# EAGLE design icyradio-upconverter (EAGLE 9.5.2)
CREVISION: 1; DESIGNER: Joao Silva

## Sheet 1 of 5: MCU
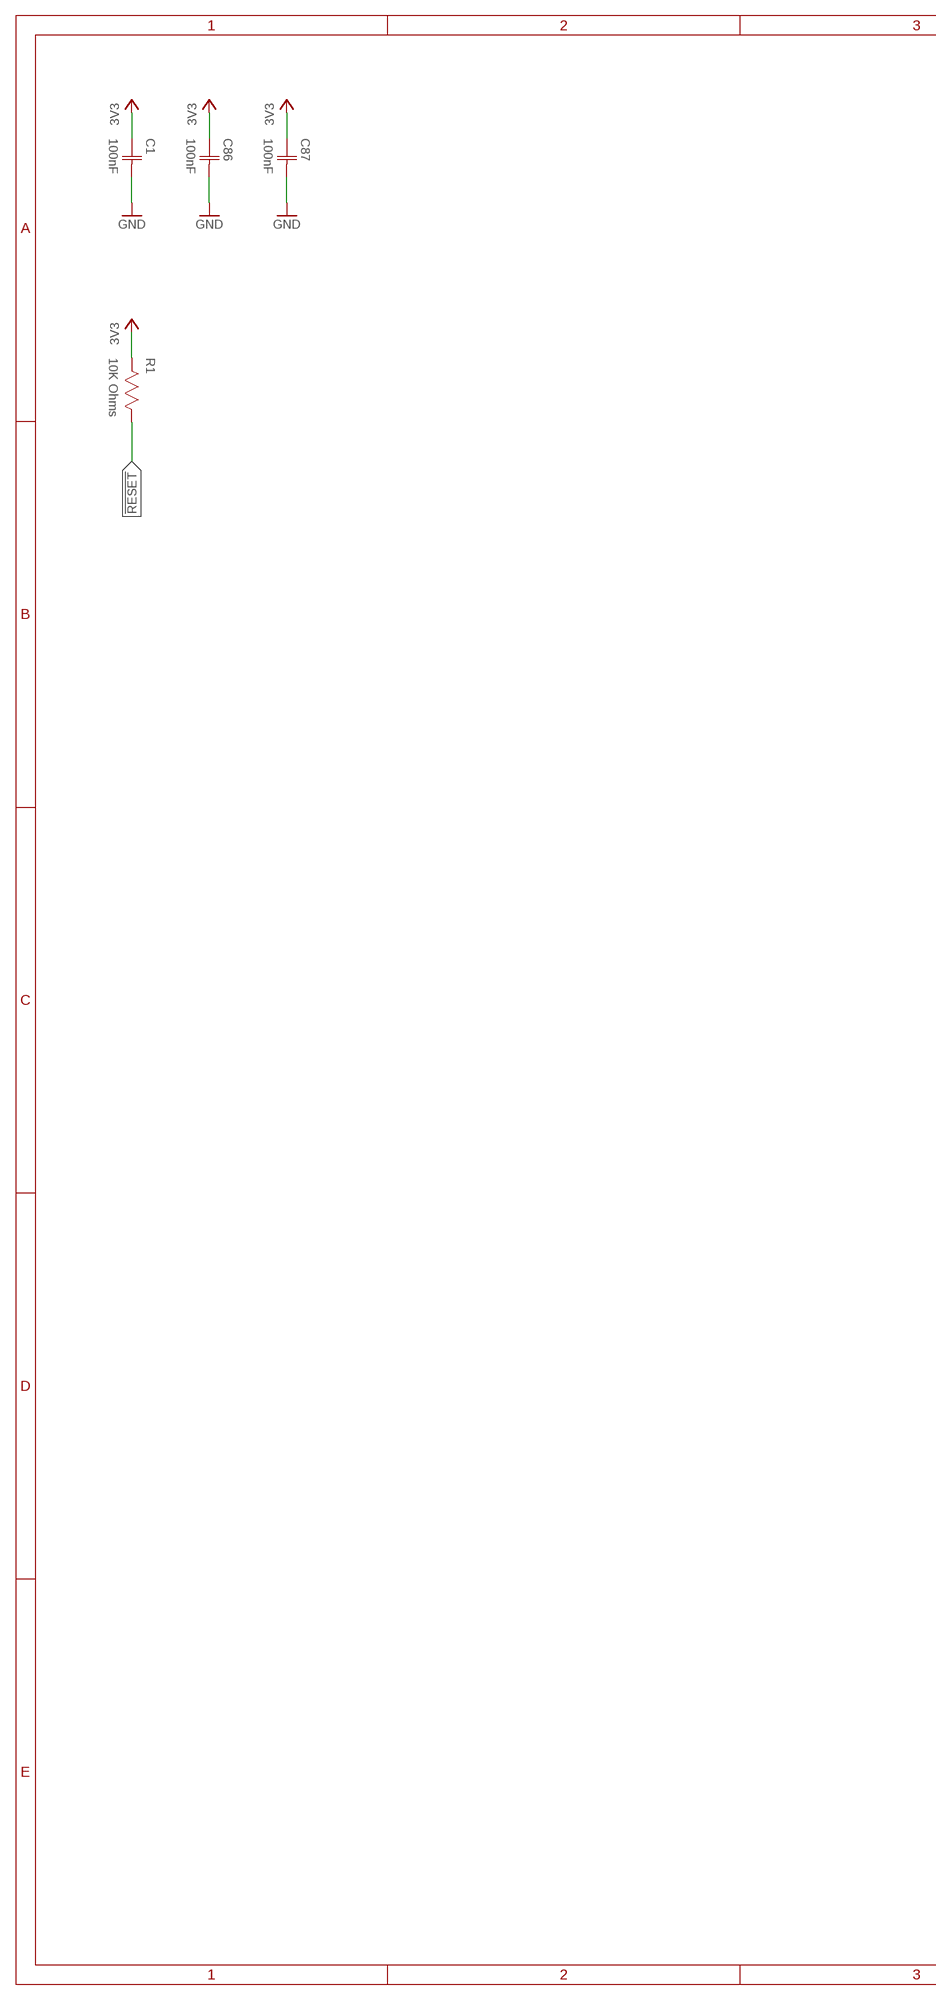
[diagram p0: schematic, sheet 1, part 1 of 2]
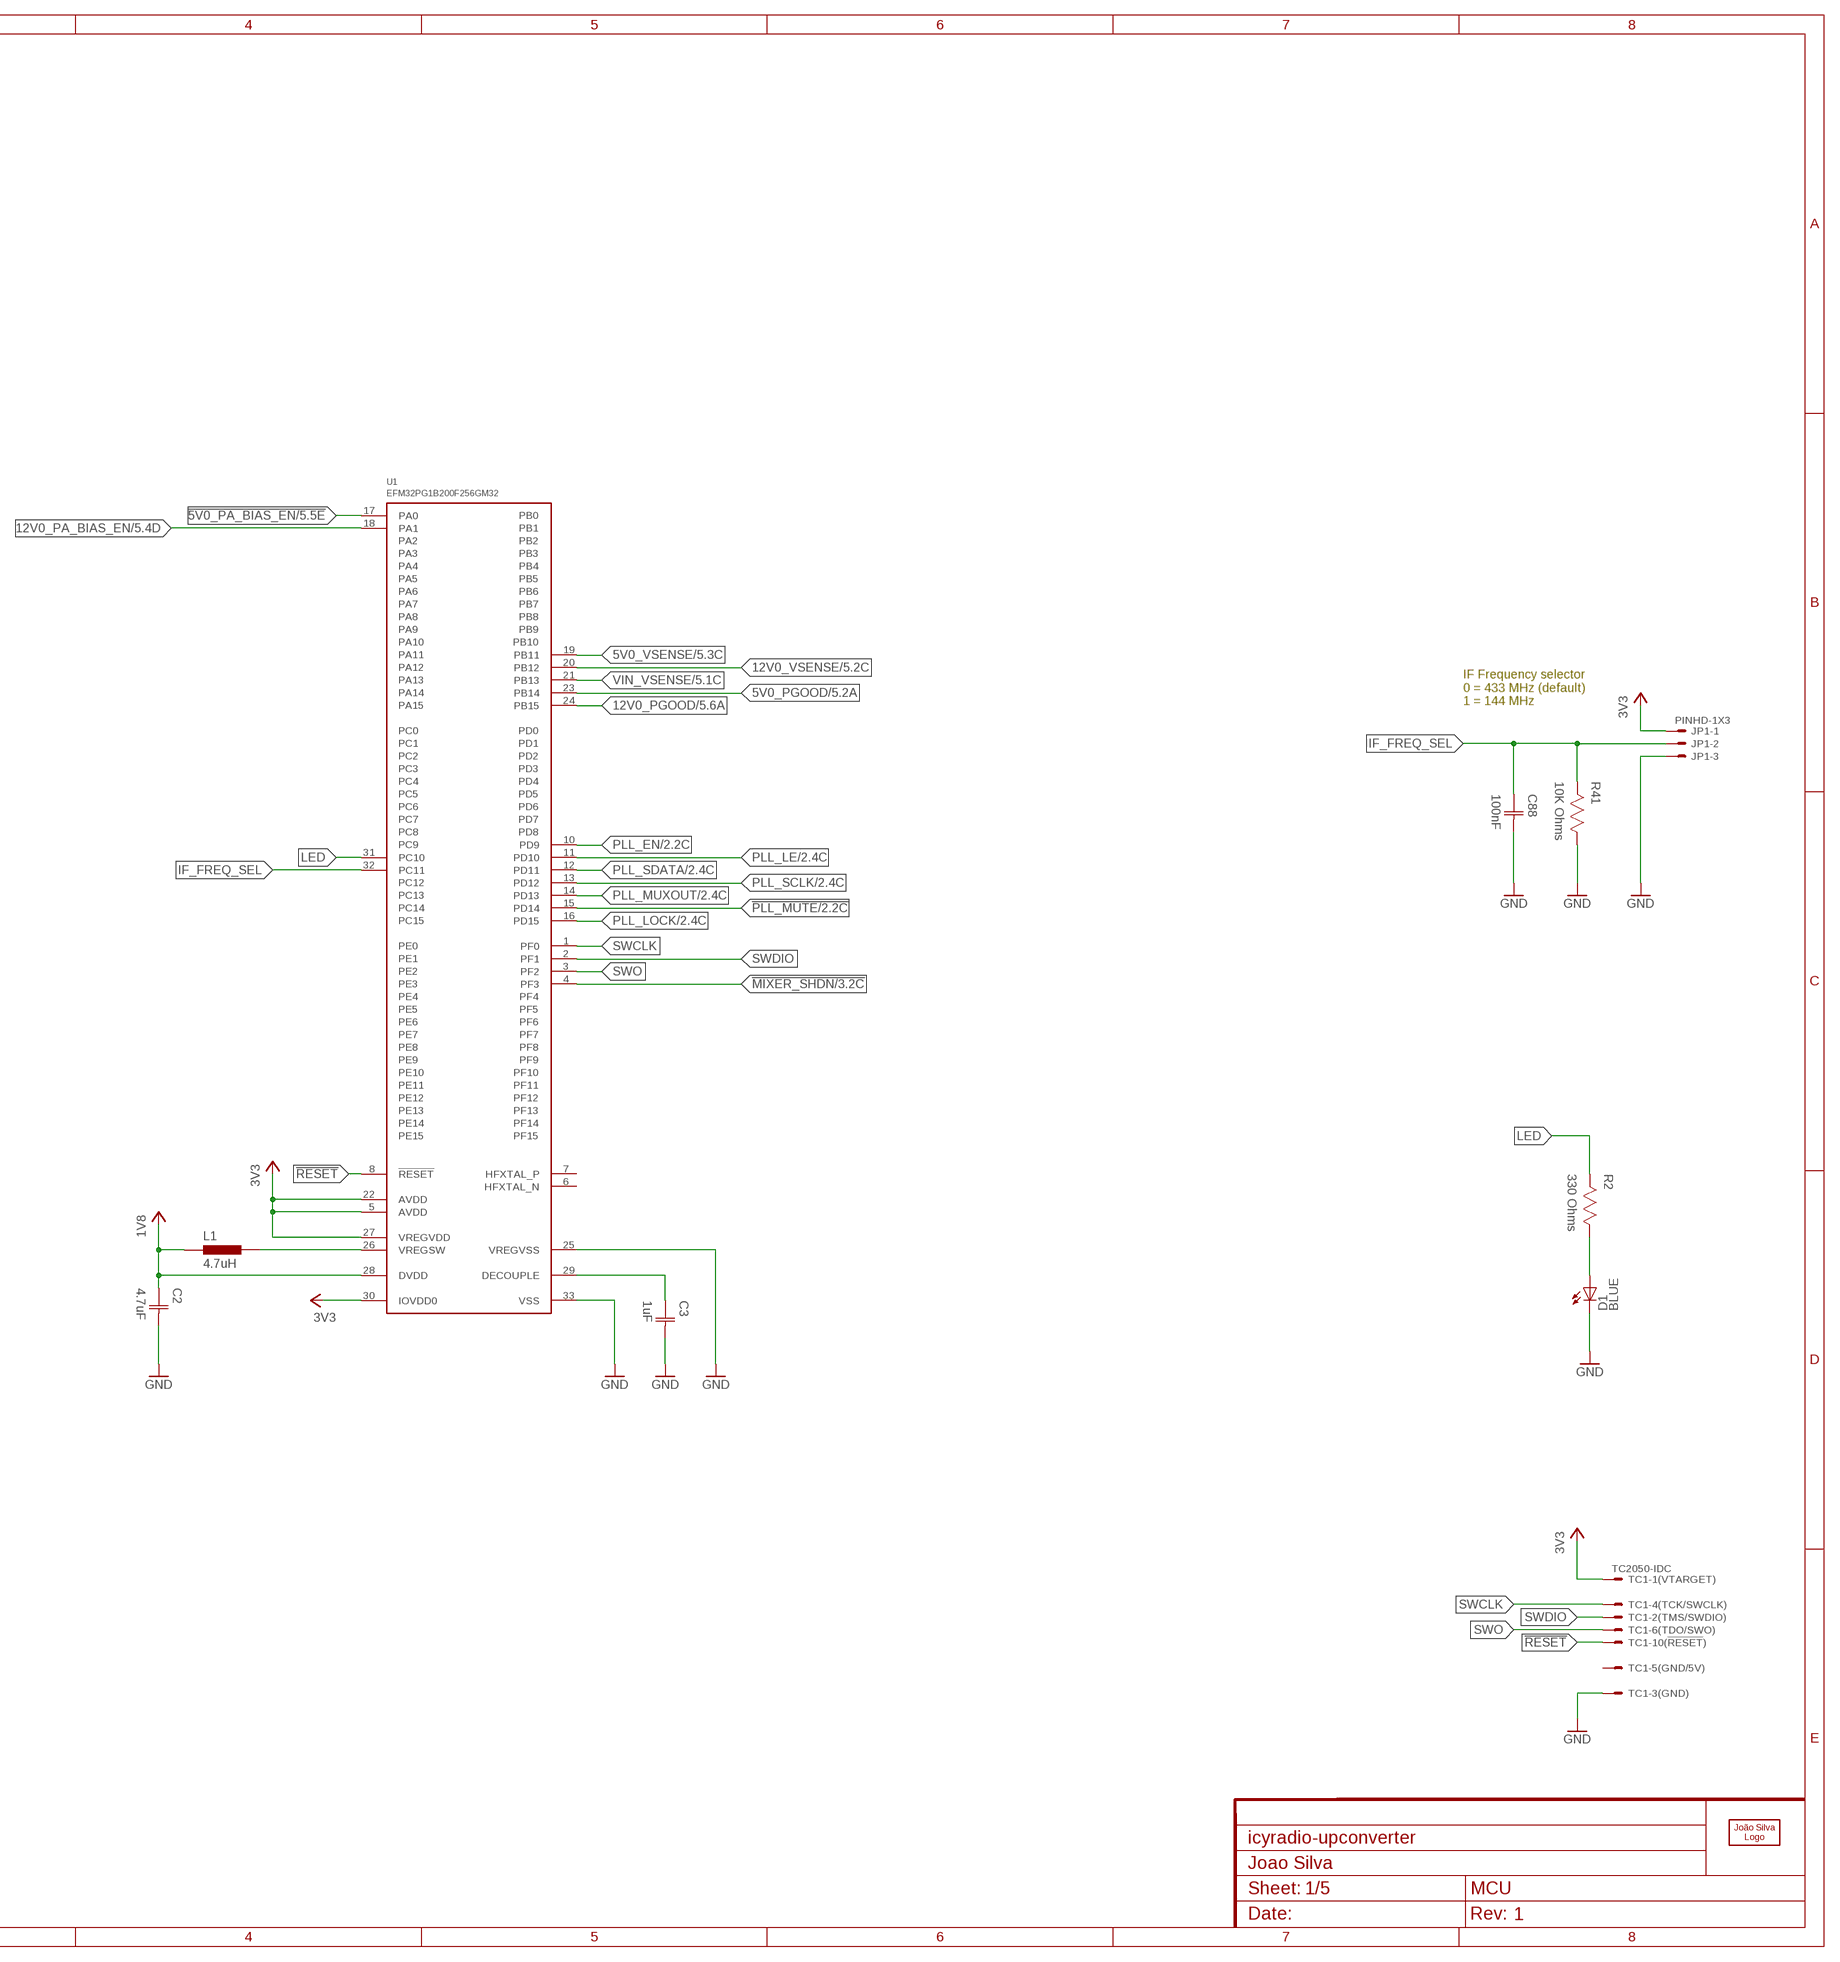
[diagram p1: schematic, sheet 1, part 2 of 2]

### Parts
C1  100nF  CAPACITOR-0603  [CAP0603]
C2  4.7uF  CAPACITOR-0603  [CAP0603]
C3  1uF  CAPACITOR-0603  [CAP0603]
C86  100nF  CAPACITOR-0603  [CAP0603]
C87  100nF  CAPACITOR-0603  [CAP0603]
C88  100nF  CAPACITOR-0603  [CAP0603]
D1  LED0603  [0603]
JP1  PINHD-1X3  [1X03]
L1  4.7uH  INDUCTOR-0603  [IND0603]
LOGO1  JS-5MM  [JS_5MM]
R1  10K Ohms  RESISTOR-0603  [RES0603]
R2  330 Ohms  RESISTOR-0603  [RES0603]
R41  10K Ohms  RESISTOR-0603  [RES0603]
TC1  TC2050-IDC  [TC2050-IDC]
U1  EFM32PG1B200F256GM32  [QFN32_0.5P_JPG]

### Nets
1V8: C2.1(C1) L1.1 U1.28(DVDD)
3V3: C1.1(C1) C86.1(C1) C87.1(C1) JP1.1 R1.2 TC1.1 U1.5(AVDD) U1.22(AVDD) U1.27(VREGVDD) U1.30(IOVDD0) ; also sheet 2,5
5V0_PGOOD: U1.23(PB14) ; also sheet 5
5V0_VSENSE: U1.19(PB11) ; also sheet 5
12V0_PA_BIAS_EN: U1.18(PA1) ; also sheet 5
12V0_PGOOD: U1.24(PB15) ; also sheet 5
12V0_VSENSE: U1.20(PB12) ; also sheet 5
!5V0_PA_BIAS_EN: U1.17(PA0) ; also sheet 5
!MIXER_SHDN: U1.4(PF3) ; also sheet 3
!PLL_MUTE: U1.15(PD14) ; also sheet 2
!RESET: R1.1 TC1.10 U1.8(!RESET)
GND: C1.2(C2) C2.2(C2) C3.2(C2) C86.2(C2) C87.2(C2) C88.2(C2) D1.C JP1.3 R41.1 TC1.3 U1.25(VREGVSS) U1.33(VSS) ; also sheet 2,3,4,5
IF_FREQ_SEL: C88.1(C1) JP1.2 R41.2 U1.32(PC11)
LED: R2.2 U1.31(PC10)
N$21: L1.2 U1.26(VREGSW)
N$22: C3.1(C1) U1.29(DECOUPLE)
N$25: D1.A R2.1
PLL_EN: U1.10(PD9) ; also sheet 2
PLL_LE: U1.11(PD10) ; also sheet 2
PLL_LOCK: U1.16(PD15) ; also sheet 2
PLL_MUXOUT: U1.14(PD13) ; also sheet 2
PLL_SCLK: U1.13(PD12) ; also sheet 2
PLL_SDATA: U1.12(PD11) ; also sheet 2
SWCLK: TC1.4 U1.1(PF0)
SWDIO: TC1.2 U1.2(PF1)
SWO: TC1.6 U1.3(PF2)
VIN_VSENSE: U1.21(PB13) ; also sheet 5
Unconnected: TC1.5 TC1.7 TC1.8 TC1.9 U1.6(HFXTAL_N) U1.7(HFXTAL_P)

### Notes on the sheet
- IF Frequency selector
  0 = 433 MHz (default)
  1 = 144 MHz

## Sheet 2 of 5: LO Synthesizer
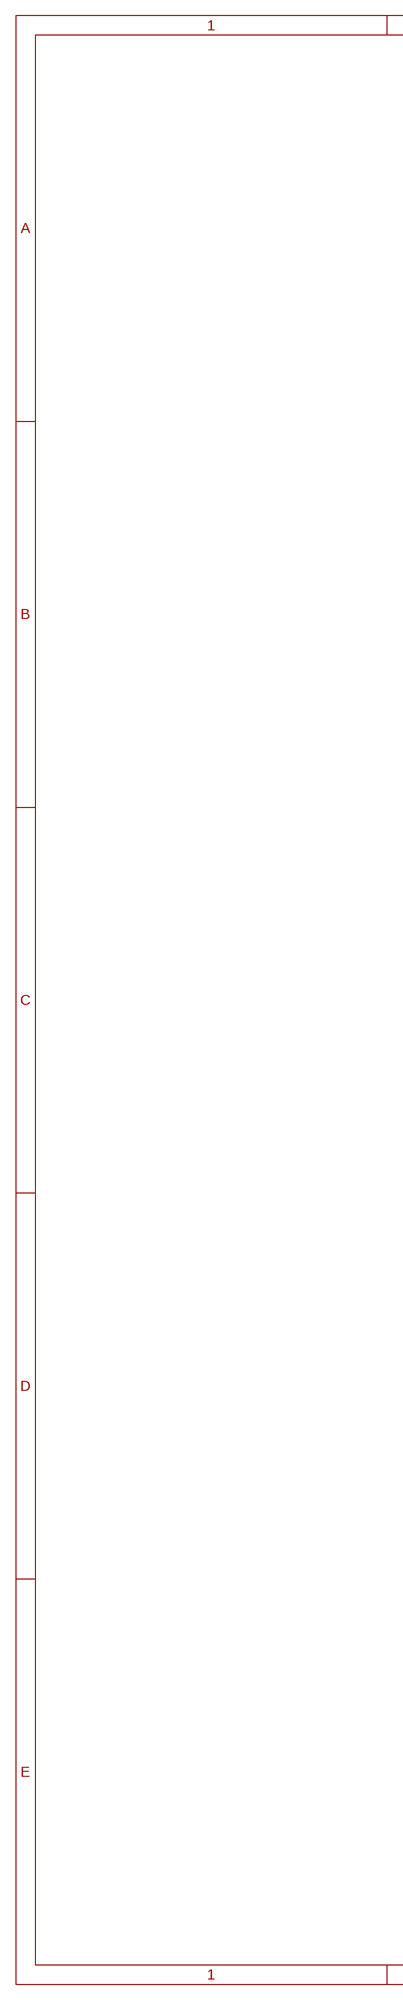
[diagram p2: schematic, sheet 2, part 1 of 2]
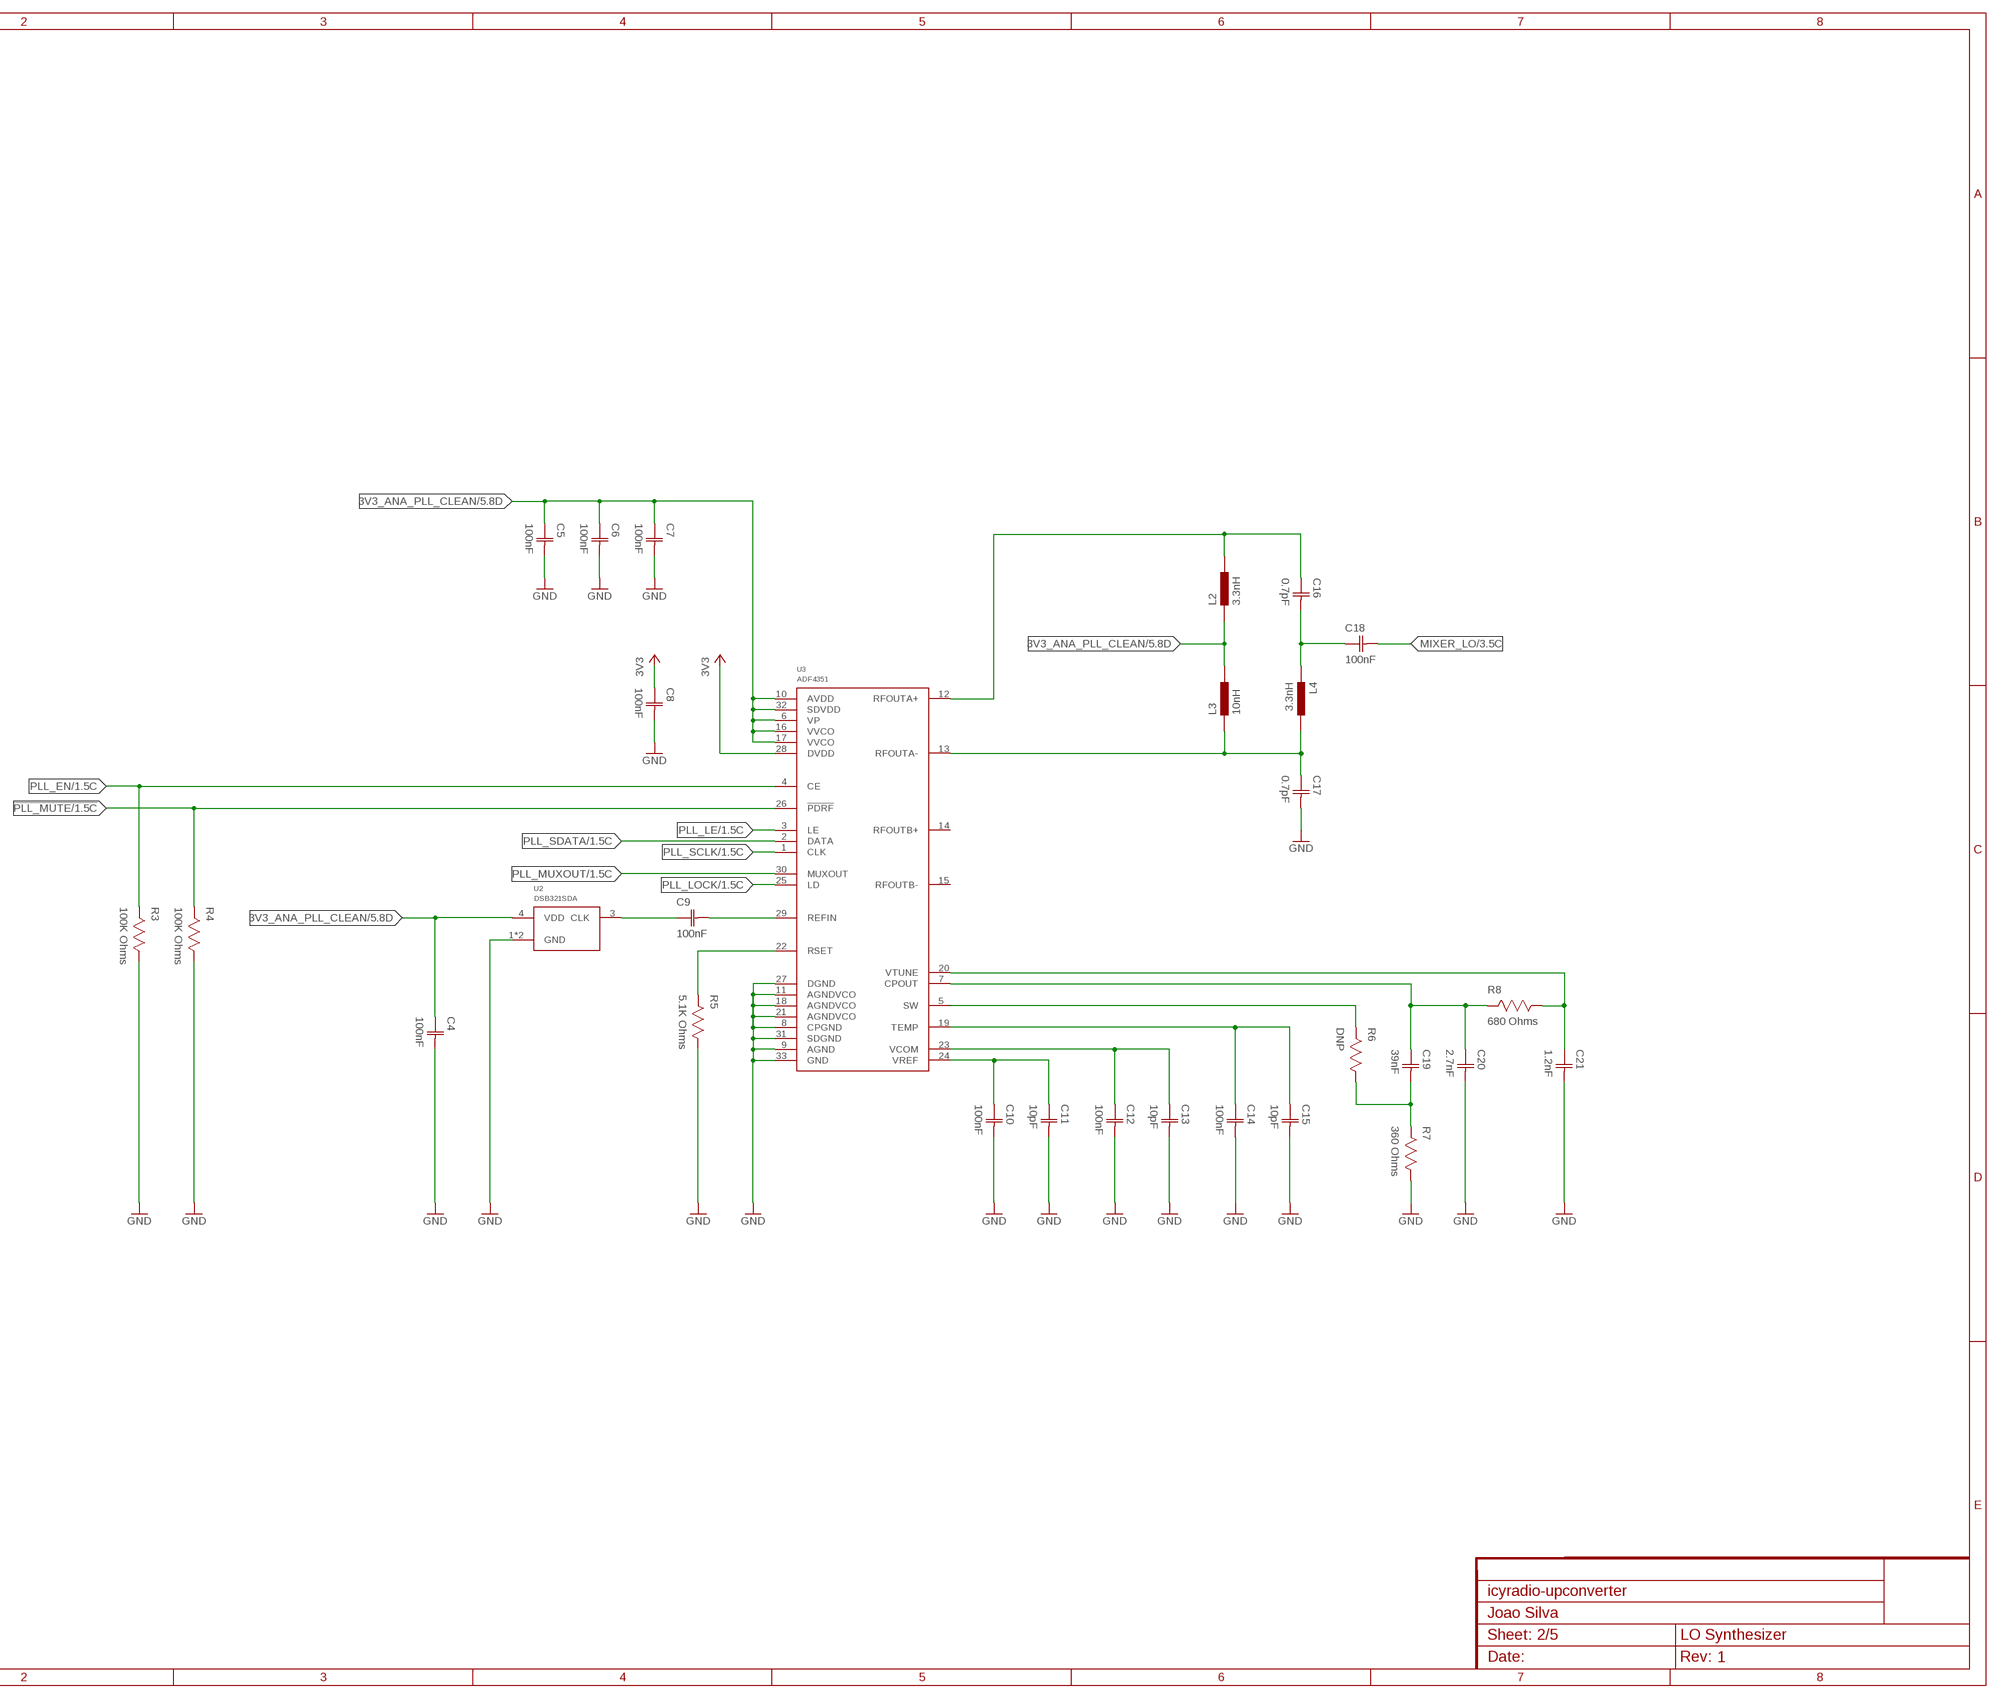
[diagram p3: schematic, sheet 2, part 2 of 2]

### Parts
C4  100nF  CAPACITOR-0603  [CAP0603]
C5  100nF  CAPACITOR-0603  [CAP0603]
C6  100nF  CAPACITOR-0603  [CAP0603]
C7  100nF  CAPACITOR-0603  [CAP0603]
C8  100nF  CAPACITOR-0603  [CAP0603]
C9  100nF  CAPACITOR-0603  [CAP0603]
C10  100nF  CAPACITOR-0603  [CAP0603]
C11  10pF  CAPACITOR-0603  [CAP0603]
C12  100nF  CAPACITOR-0603  [CAP0603]
C13  10pF  CAPACITOR-0603  [CAP0603]
C14  100nF  CAPACITOR-0603  [CAP0603]
C15  10pF  CAPACITOR-0603  [CAP0603]
C16  0.7pF  CAPACITOR-0603  [CAP0603]
C17  0.7pF  CAPACITOR-0603  [CAP0603]
C18  100nF  CAPACITOR-0603  [CAP0603]
C19  39nF  CAPACITOR-0603  [CAP0603]
C20  2.7nF  CAPACITOR-0603  [CAP0603]
C21  1.2nF  CAPACITOR-0603  [CAP0603]
L2  3.3nH  INDUCTOR-0603  [IND0603]
L3  10nH  INDUCTOR-0603  [IND0603]
L4  3.3nH  INDUCTOR-0603  [IND0603]
R3  100K Ohms  RESISTOR-0603  [RES0603]
R4  100K Ohms  RESISTOR-0603  [RES0603]
R5  5.1K Ohms  RESISTOR-0603  [RES0603]
R6  DNP  RESISTOR-0603  [RES0603]
R7  360 Ohms  RESISTOR-0603  [RES0603]
R8  680 Ohms  RESISTOR-0603  [RES0603]
U2  DSB321SDA  [TCXO-3225]
U3  ADF4351  [QFN32]

### Nets
3V3: C8.1(C1) U3.28(DVDD) ; also sheet 1,5
3V3_ANA_PLL_CLEAN: C4.1(C1) C5.1(C1) C6.1(C1) C7.1(C1) L2.1 L3.2 U2.4(VDD) U3.6(VP) U3.10(AVDD) U3.16(VVCO) U3.17(VVCO) U3.32(SDVDD) ; also sheet 5
!PLL_MUTE: R4.2 U3.26(!PDRF) ; also sheet 1
GND: C4.2(C2) C5.2(C2) C6.2(C2) C7.2(C2) C8.2(C2) C10.2(C2) C11.2(C2) C12.2(C2) C13.2(C2) C14.2(C2) C15.2(C2) C17.2(C2) C20.2(C2) C21.2(C2) R3.1 R4.1 R5.1 R7.1 U2.1(GND) U2.2(GND) U3.8(CPGND) U3.9(AGND) U3.11(AGNDVCO) U3.18(AGNDVCO) U3.21(AGNDVCO) U3.27(DGND) U3.31(SDGND) U3.33(GND) ; also sheet 1,3,4,5
MIXER_LO: C18.2(C2) ; also sheet 3
N$1: C16.2(C2) C18.1(C1) L4.1
N$67: C17.1(C1) L3.1 L4.2 U3.13(RFOUTA-)
N$69: C16.1(C1) L2.2 U3.12(RFOUTA+)
N$84: C19.2(C2) R6.1 R7.2
N$88: R5.2 U3.22(RSET)
PLL_CP_VOUT: C19.1(C1) C20.1(C1) R8.2 U3.7(CPOUT)
PLL_EN: R3.2 U3.4(CE) ; also sheet 1
PLL_FASTLOCK_SW: R6.2 U3.5(SW)
PLL_LE: U3.3(LE) ; also sheet 1
PLL_LOCK: U3.25(LD) ; also sheet 1
PLL_MUXOUT: U3.30(MUXOUT) ; also sheet 1
PLL_REF_ACC: C9.2(C2) U3.29(REFIN)
PLL_REF_DCC: C9.1(C1) U2.3(CLK)
PLL_SCLK: U3.1(CLK) ; also sheet 1
PLL_SDATA: U3.2(DATA) ; also sheet 1
PLL_TEMP: C14.1(C1) C15.1(C1) U3.19(TEMP)
PLL_VCOM: C12.1(C1) C13.1(C1) U3.23(VCOM)
PLL_VREF: C10.1(C1) C11.1(C1) U3.24(VREF)
PLL_VTUNE: C21.1(C1) R8.1 U3.20(VTUNE)
Unconnected: U3.14(RFOUTB+) U3.15(RFOUTB-)

## Sheet 3 of 5: Mixer + Filter
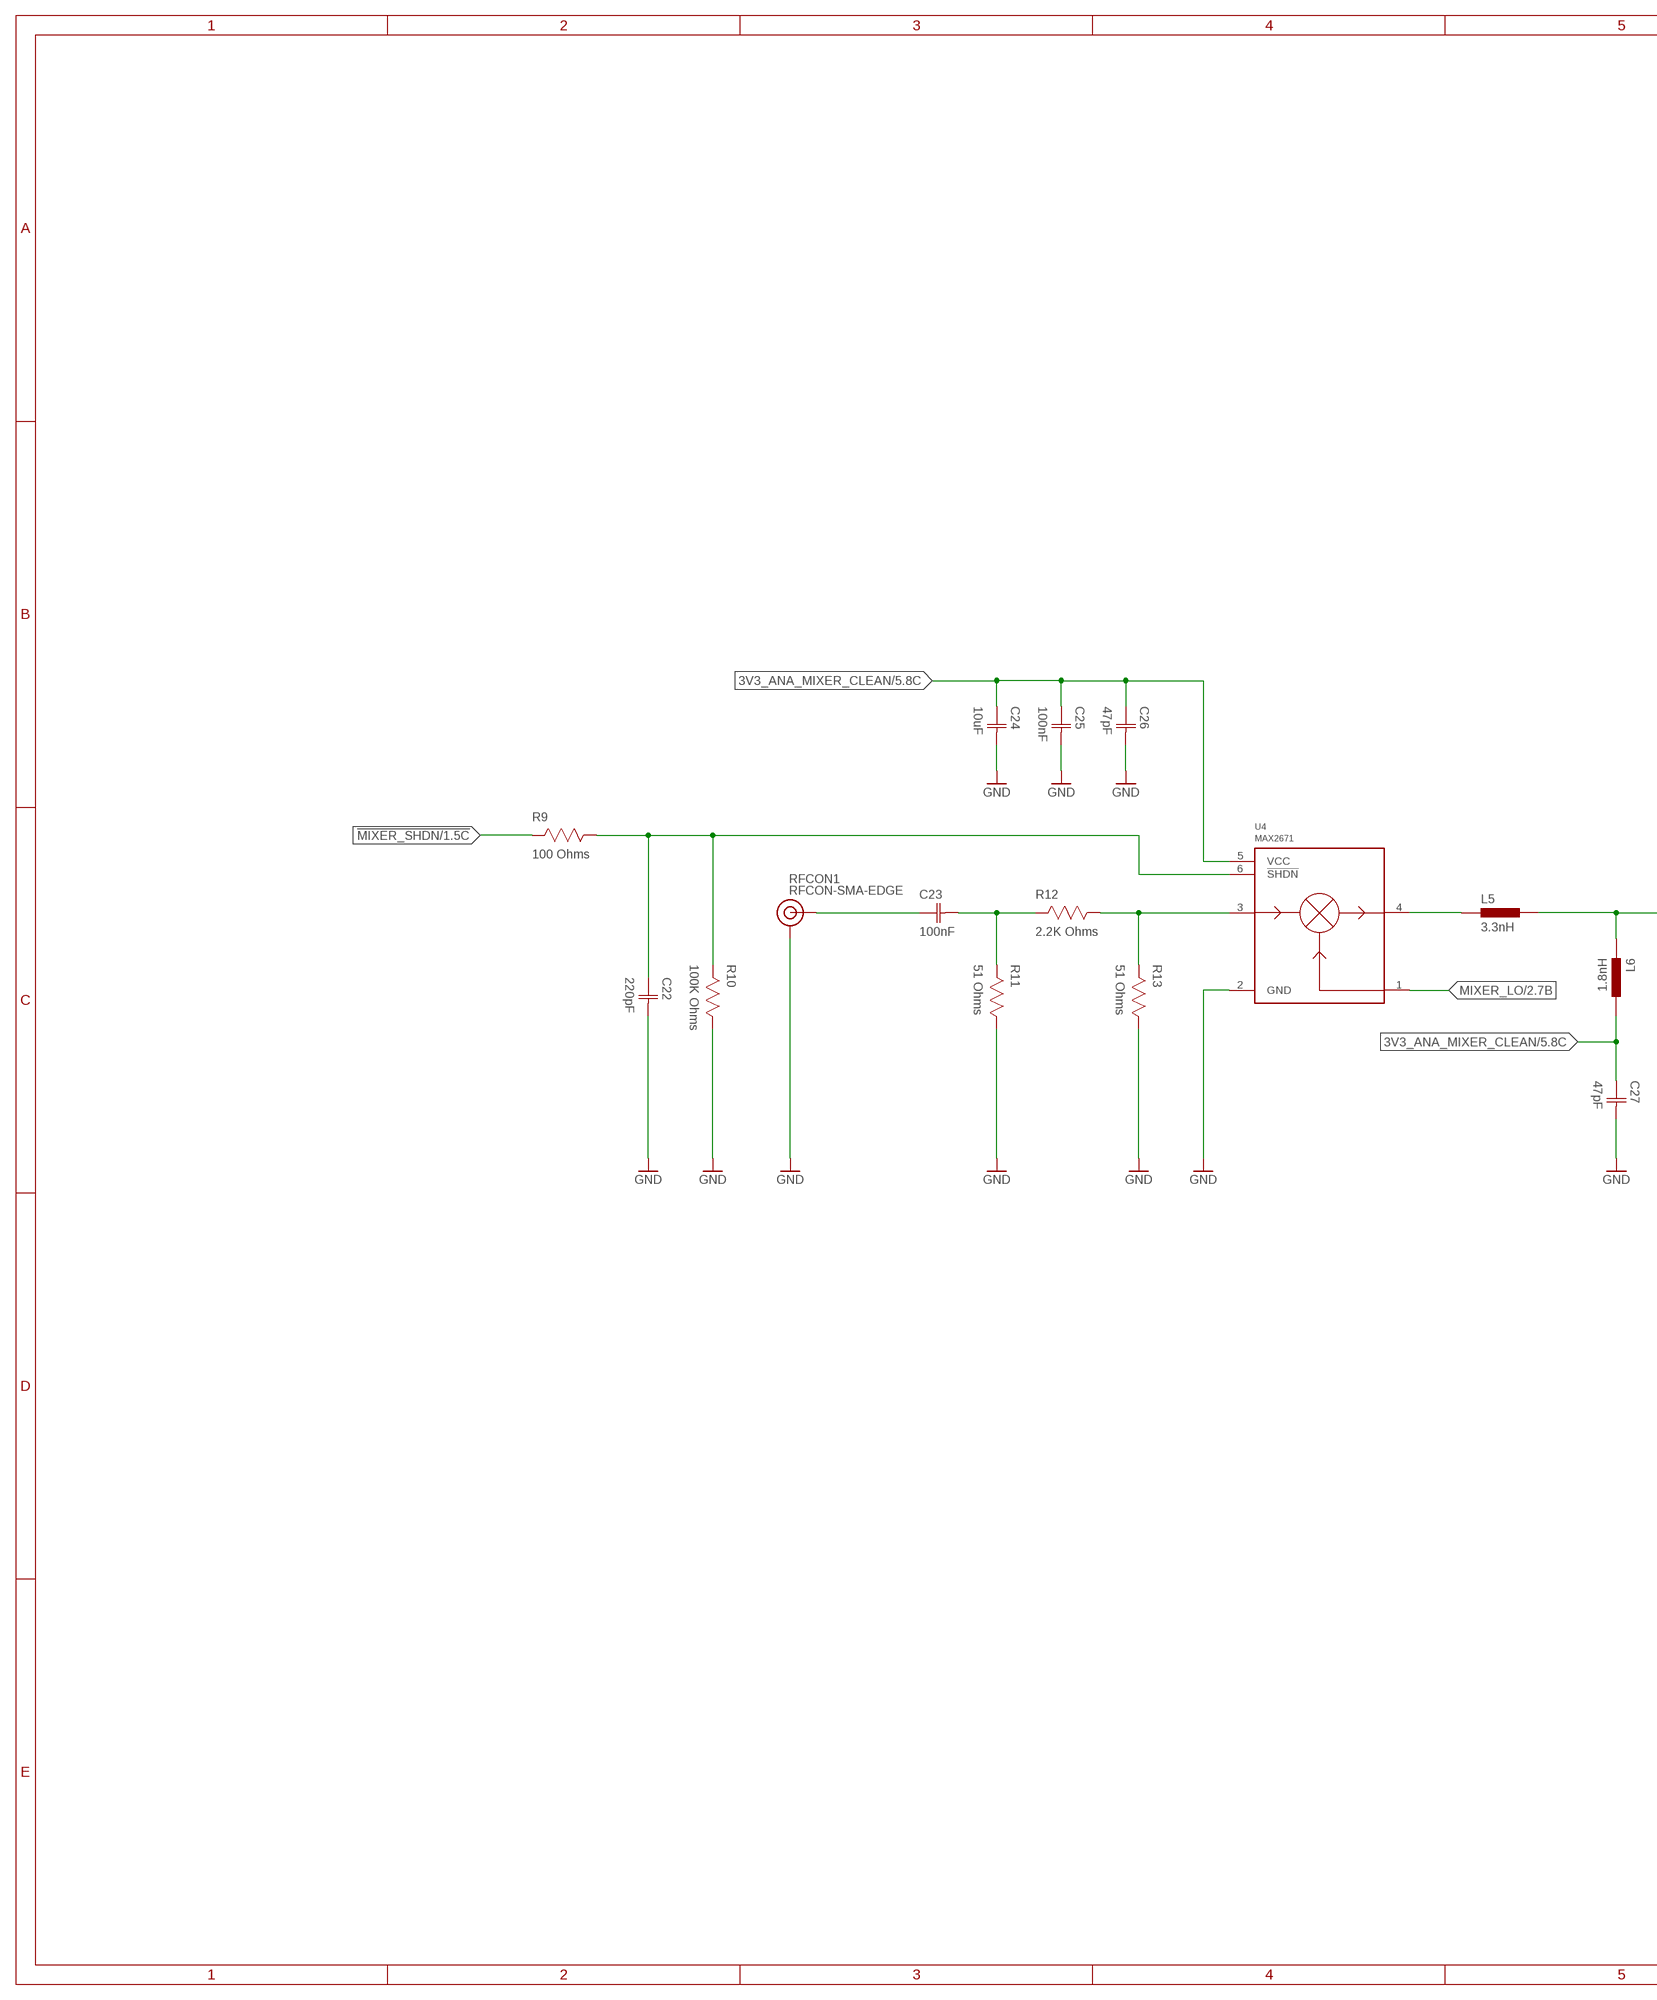
[diagram p4: schematic, sheet 3, part 1 of 2]
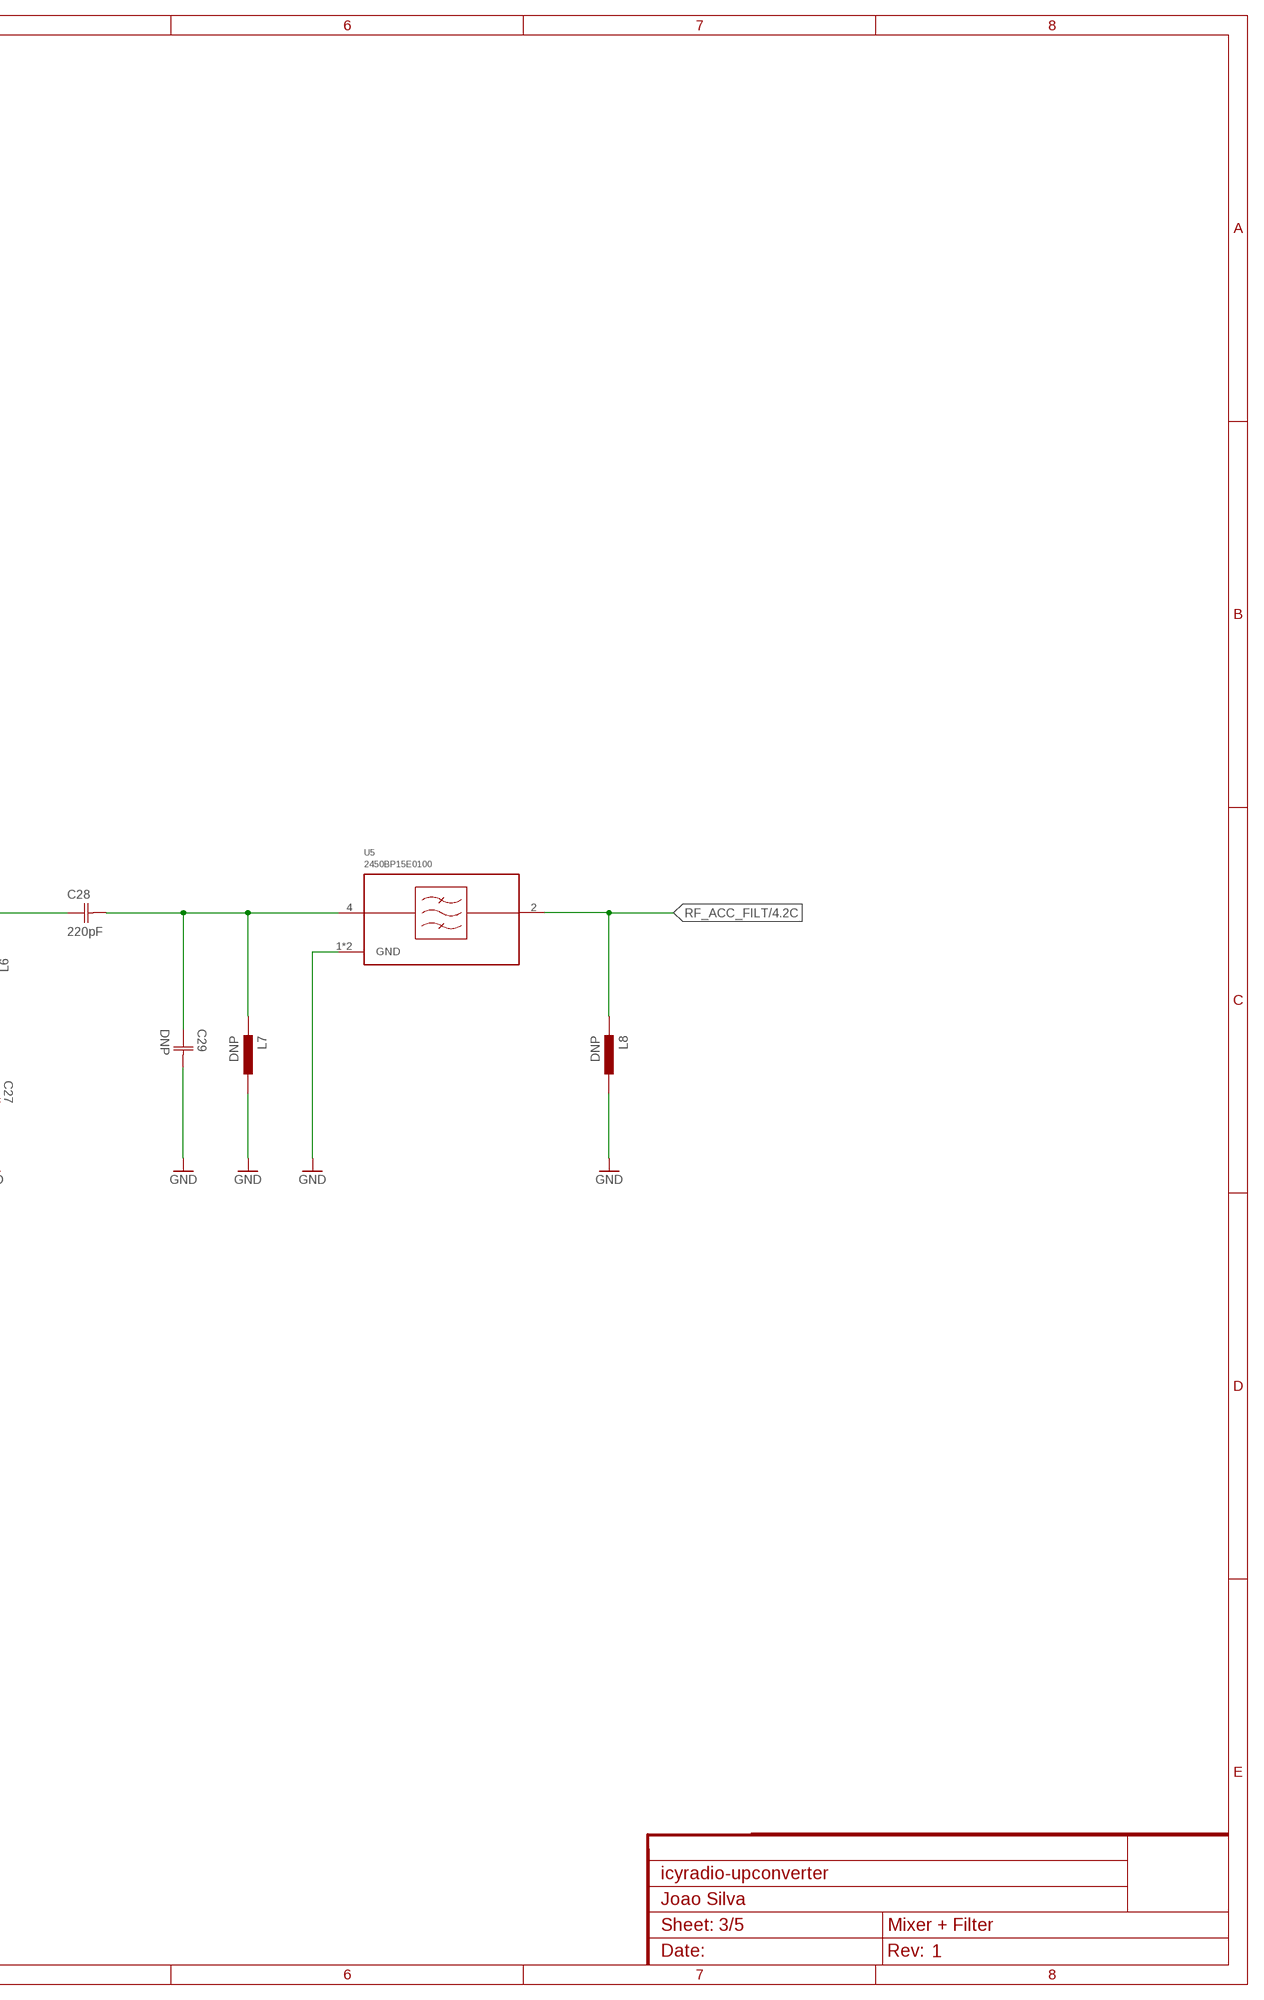
[diagram p5: schematic, sheet 3, part 2 of 2]

### Parts
C22  220pF  CAPACITOR-0603  [CAP0603]
C23  100nF  CAPACITOR-0603  [CAP0603]
C24  10uF  CAPACITOR-0603  [CAP0603]
C25  100nF  CAPACITOR-0603  [CAP0603]
C26  47pF  CAPACITOR-0603  [CAP0603]
C27  47pF  CAPACITOR-0603  [CAP0603]
C28  220pF  CAPACITOR-0603  [CAP0603]
C29  DNP  CAPACITOR-0603  [CAP0603]
L5  3.3nH  INDUCTOR-0603  [IND0603]
L6  1.8nH  INDUCTOR-0603  [IND0603]
L7  DNP  INDUCTOR-0603  [IND0603]
L8  DNP  INDUCTOR-0603  [IND0603]
R9  100 Ohms  RESISTOR-0603  [RES0603]
R10  100K Ohms  RESISTOR-0603  [RES0603]
R11  51 Ohms  RESISTOR-0603  [RES0603]
R12  2.2K Ohms  RESISTOR-0603  [RES0603]
R13  51 Ohms  RESISTOR-0603  [RES0603]
RFCON1  RFCON-SMA-EDGE  [SMA-EDGE]
U4  MAX2671  [SOT23-6]
U5  2450BP15E0100  [2450BP15E0100]

### Nets
3V3_ANA_MIXER_CLEAN: C24.1(C1) C25.1(C1) C26.1(C1) C27.1(C1) L6.2 U4.5(VCC) ; also sheet 5
!MIXER_SHDN: R9.2 ; also sheet 1
GND: C22.2(C2) C24.2(C2) C25.2(C2) C26.2(C2) C27.2(C2) C29.2(C2) L7.2 L8.2 R10.1 R11.1 R13.1 RFCON1.GND@0(GND) RFCON1.GND@1(GND) RFCON1.GND@2(GND) RFCON1.GND@3(GND) U4.2(GND) U5.1(GND) U5.3(GND) ; also sheet 1,2,4,5
IF_IN_ACC: R12.1 R13.2 U4.3(IFIN)
IF_IN_DCC: C23.1(C1) RFCON1.SIG(SIGNAL)
MIXER_LO: U4.1(LO) ; also sheet 2
N$4: C22.1(C1) R9.1 R10.2 U4.6(!SHDN)
N$6: C28.1(C1) L5.2 L6.1
N$7: L5.1 U4.4(RFOUT)
N$26: C23.2(C2) R11.2 R12.2
RF_ACC: C28.2(C2) C29.1(C1) L7.1 U5.4(RFIN)
RF_ACC_FILT: L8.1 U5.2(RFOUT) ; also sheet 4

## Sheet 4 of 5: Amplifiers
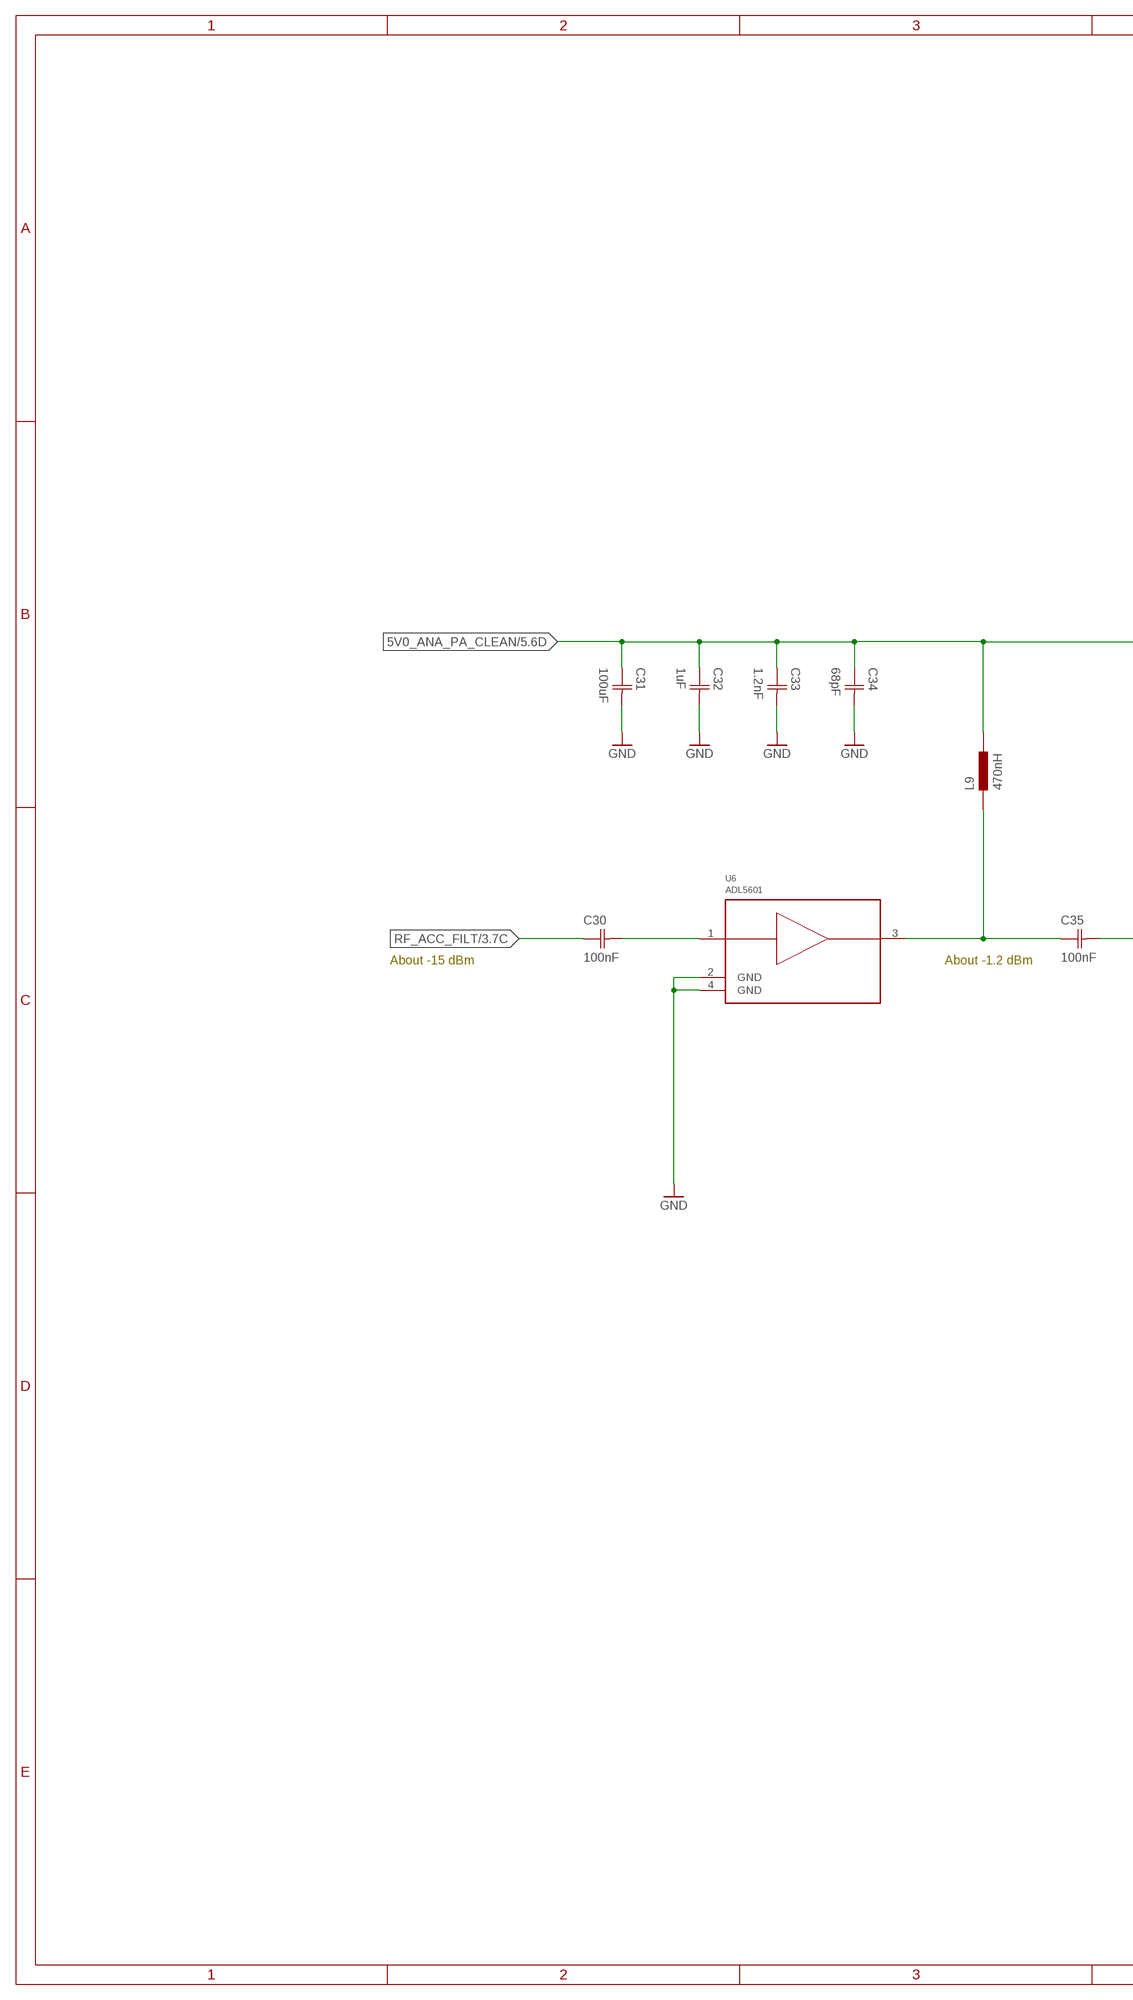
[diagram p6: schematic, sheet 4, part 1 of 2]
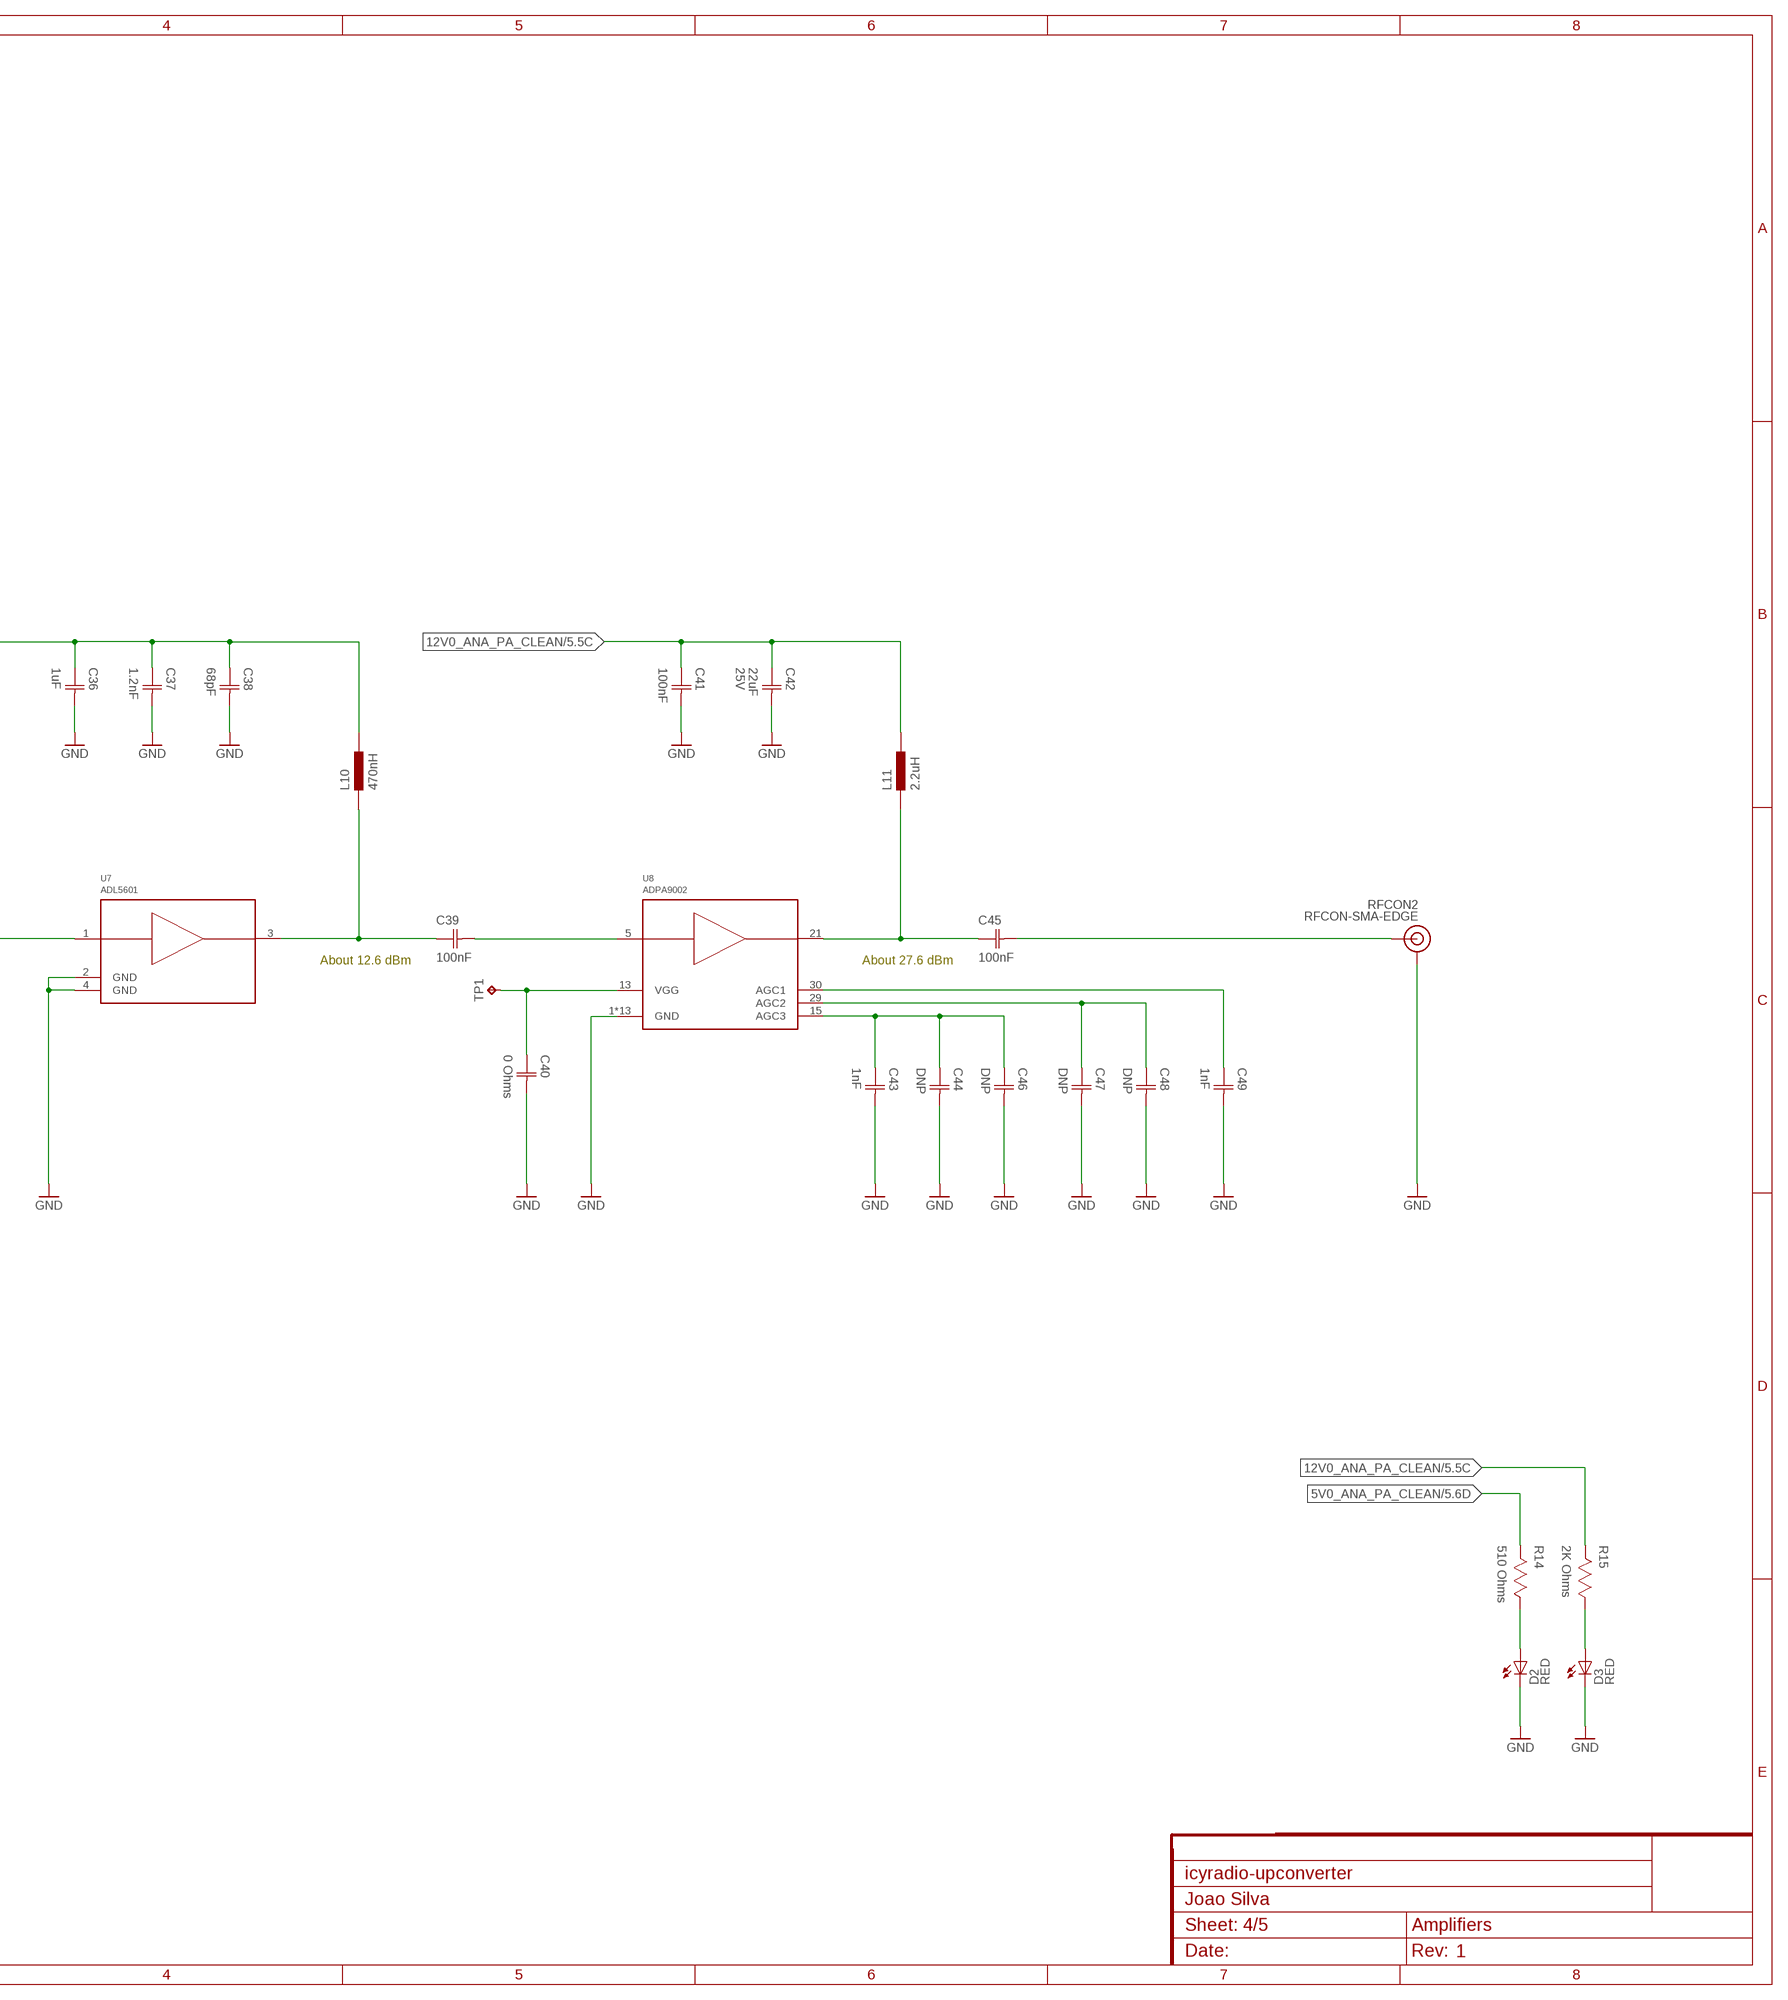
[diagram p7: schematic, sheet 4, part 2 of 2]

### Parts
C30  100nF  CAPACITOR-0603  [CAP0603]
C31  100uF  CAPACITOR-1206  [CAP1206]
C32  1uF  CAPACITOR-0603  [CAP0603]
C33  1.2nF  CAPACITOR-0603  [CAP0603]
C34  68pF  CAPACITOR-0603  [CAP0603]
C35  100nF  CAPACITOR-0603  [CAP0603]
C36  1uF  CAPACITOR-0603  [CAP0603]
C37  1.2nF  CAPACITOR-0603  [CAP0603]
C38  68pF  CAPACITOR-0603  [CAP0603]
C39  100nF  CAPACITOR-0603  [CAP0603]
C40  0 Ohms  CAPACITOR-0603  [CAP0603]
C41  100nF  CAPACITOR-0603  [CAP0603]
C42  22uF  CAPACITOR-1206  [CAP1206]
C43  1nF  CAPACITOR-0603  [CAP0603]
C44  DNP  CAPACITOR-0603  [CAP0603]
C45  100nF  CAPACITOR-0603  [CAP0603]
C46  DNP  CAPACITOR-0603  [CAP0603]
C47  DNP  CAPACITOR-0603  [CAP0603]
C48  DNP  CAPACITOR-0603  [CAP0603]
C49  1nF  CAPACITOR-0603  [CAP0603]
D2  LED0603  [0603]
D3  LED0603  [0603]
L9  470nH  INDUCTOR-0603  [IND0603]
L10  470nH  INDUCTOR-0603  [IND0603]
L11  2.2uH  INDUCTOR-0603  [IND0603]
R14  510 Ohms  RESISTOR-0603  [RES0603]
R15  2K Ohms  RESISTOR-0603  [RES0603]
RFCON2  RFCON-SMA-EDGE  [SMA-EDGE]
TP1  TESTPOINT-1.27MM  [PAD1.27MM]
U6  ADL5601  [SOT89]
U7  ADL5601  [SOT89]
U8  ADPA9002  [QFN32]

### Nets
5V0_ANA_PA_CLEAN: C31.1(C1) C32.1(C1) C33.1(C1) C34.1(C1) C36.1(C1) C37.1(C1) C38.1(C1) L9.2 L10.2 R14.2 ; also sheet 5
12V0_ANA_PA_CLEAN: C41.1(C1) C42.1(C1) L11.2 R15.2 ; also sheet 5
GND: C31.2(C2) C32.2(C2) C33.2(C2) C34.2(C2) C36.2(C2) C37.2(C2) C38.2(C2) C40.2(C2) C41.2(C2) C42.2(C2) C43.2(C2) C44.2(C2) C46.2(C2) C47.2(C2) C48.2(C2) C49.2(C2) D2.C D3.C RFCON2.GND@0(GND) RFCON2.GND@1(GND) RFCON2.GND@2(GND) RFCON2.GND@3(GND) U6.2(GND) U6.4(GND) U7.2(GND) U7.4(GND) U8.1(GND) U8.4(GND) U8.6(GND) U8.8(GND) U8.9(GND) U8.16(GND) U8.17(GND) U8.20(GND) U8.22(GND) U8.24(GND) U8.25(GND) U8.32(GND) U8.33(GND) ; also sheet 1,2,3,5
N$8: C43.1(C1) C44.1(C1) C46.1(C1) U8.15(AGC3)
N$9: C47.1(C1) C48.1(C1) U8.29(AGC2)
N$10: C49.1(C1) U8.30(AGC1)
N$11: C40.1(C1) TP1.TP U8.13(VGG)
N$12: C30.2(C2) U6.1(RFIN)
N$13: C45.1(C1) L11.1 U8.21(RFOUT)
N$14: C35.1(C1) L9.1 U6.3(RFOUT)
N$15: C35.2(C2) U7.1(RFIN)
N$16: C39.1(C1) L10.1 U7.3(RFOUT)
N$17: C39.2(C2) U8.5(RFIN)
N$18: C45.2(C2) RFCON2.SIG(SIGNAL)
N$23: D2.A R14.1
N$24: D3.A R15.1
RF_ACC_FILT: C30.1(C1) ; also sheet 3

### Notes on the sheet
- About -15 dBm | About -1.2 dBm | About 12.6 dBm | About 27.6 dBm

## Sheet 5 of 5: Power
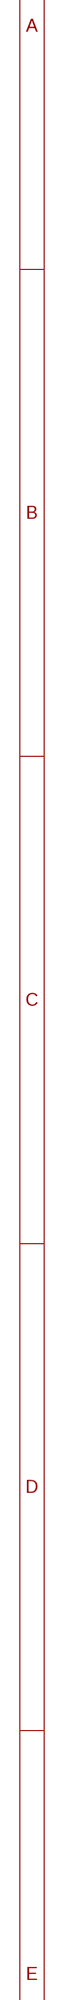
[diagram p8: schematic, sheet 5, part 1 of 2]
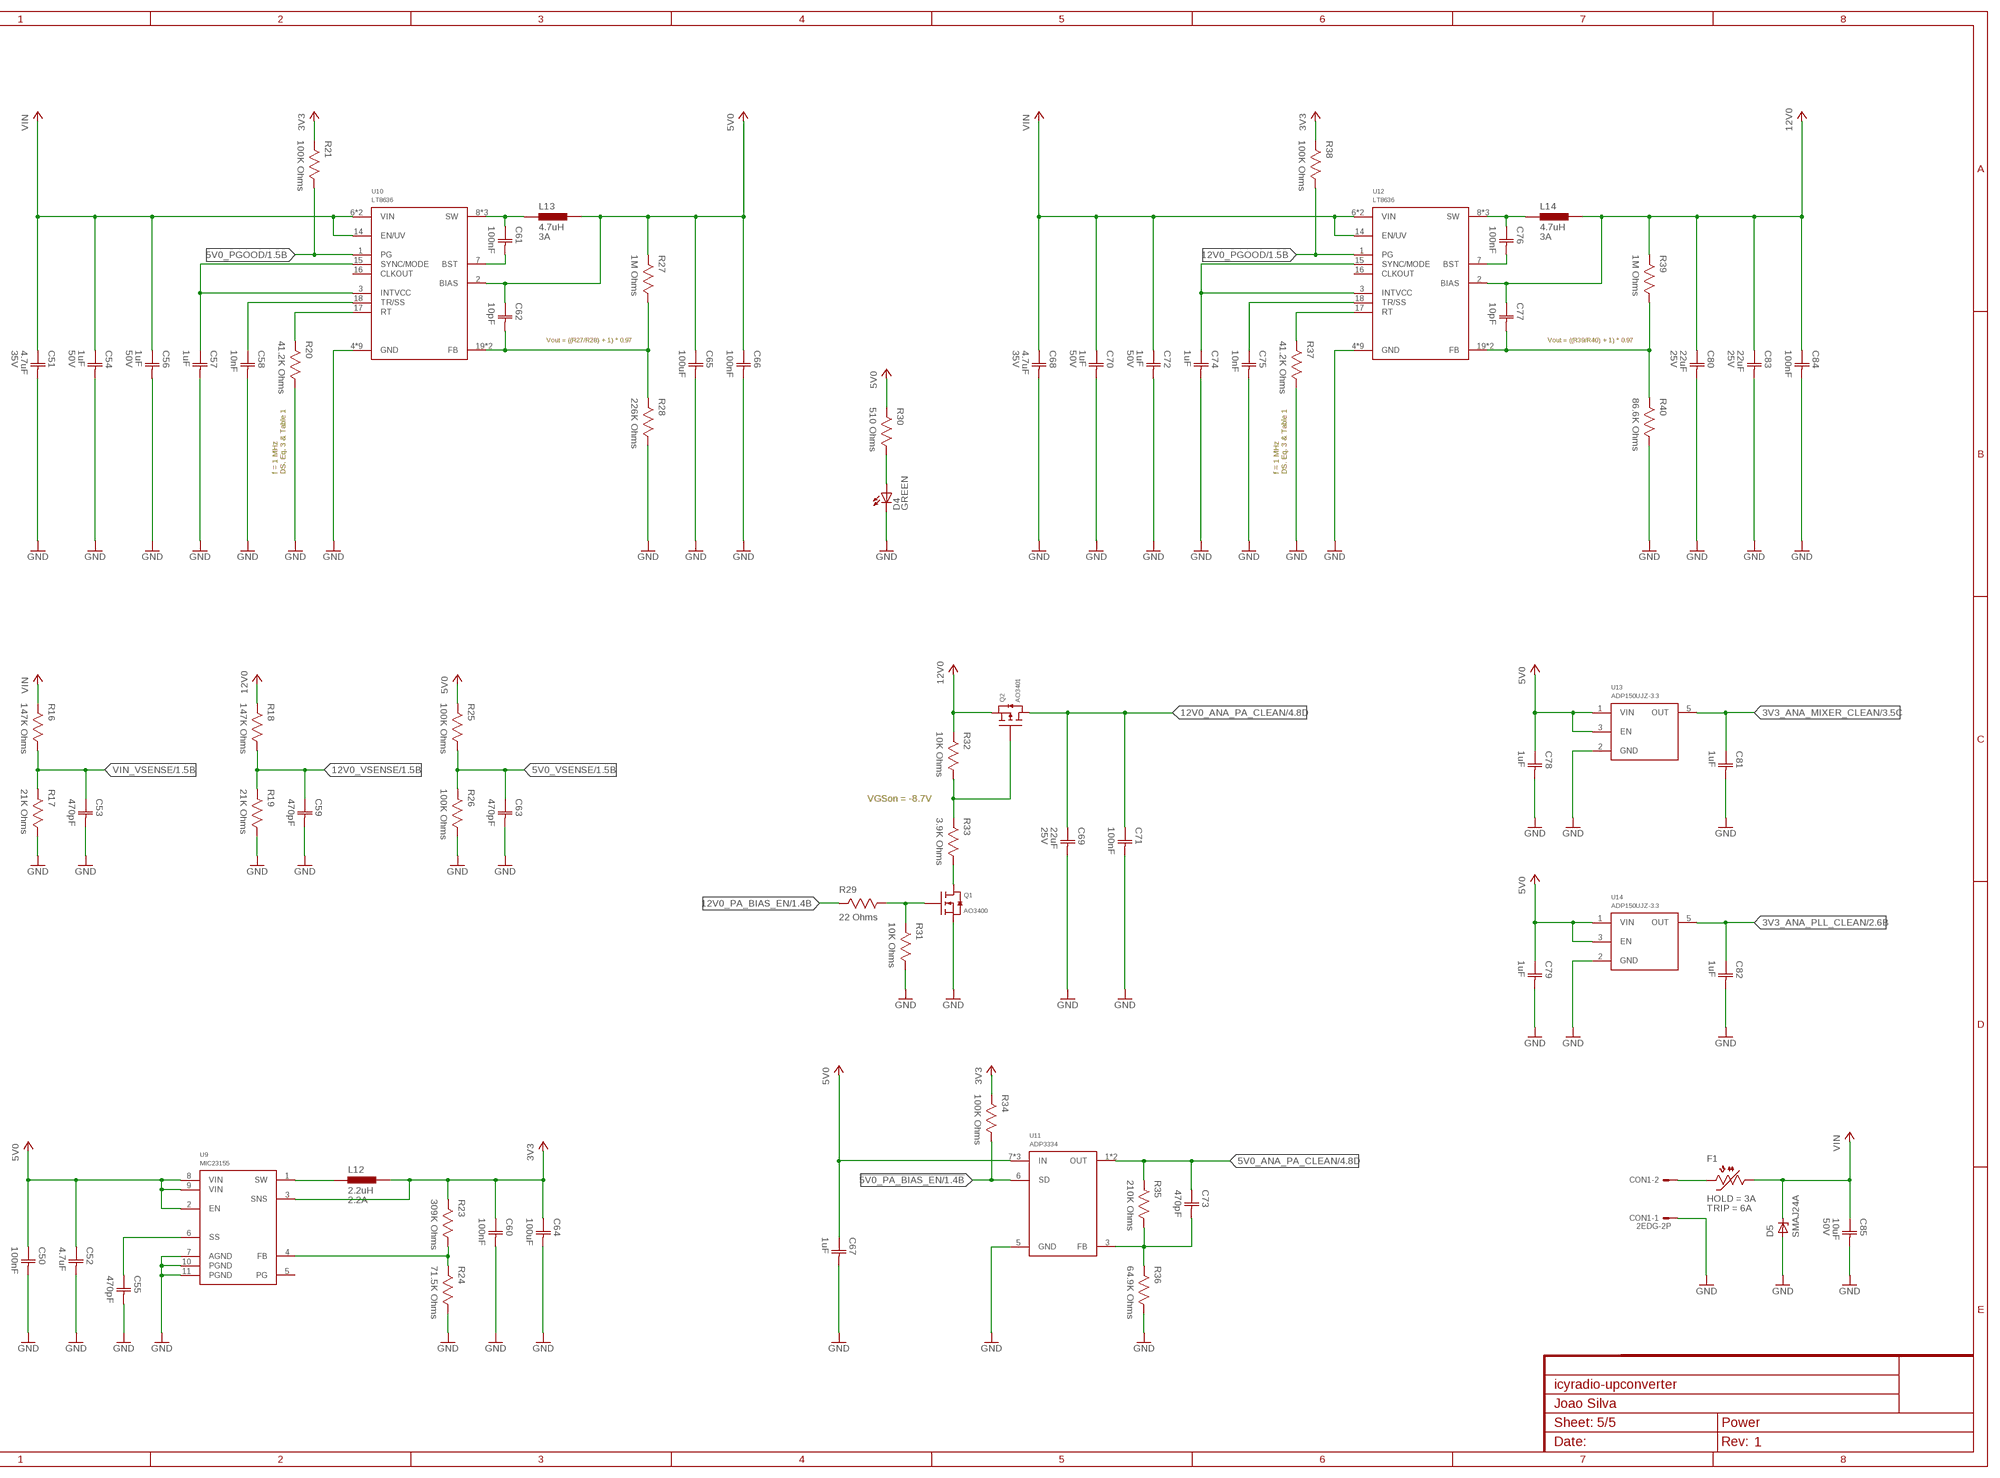
[diagram p9: schematic, sheet 5, part 2 of 2]

### Parts
C50  100nF  CAPACITOR-0603  [CAP0603]
C51  4.7uF  CAPACITOR-0603  [CAP0603]
C52  4.7uF  CAPACITOR-0603  [CAP0603]
C53  470pF  CAPACITOR-0603  [CAP0603]
C54  1uF  CAPACITOR-0603  [CAP0603]
C55  470pF  CAPACITOR-0603  [CAP0603]
C56  1uF  CAPACITOR-0603  [CAP0603]
C57  1uF  CAPACITOR-0603  [CAP0603]
C58  10nF  CAPACITOR-0603  [CAP0603]
C59  470pF  CAPACITOR-0603  [CAP0603]
C60  100nF  CAPACITOR-0603  [CAP0603]
C61  100nF  CAPACITOR-0603  [CAP0603]
C62  10pF  CAPACITOR-0603  [CAP0603]
C63  470pF  CAPACITOR-0603  [CAP0603]
C64  100uF  CAPACITOR-1206  [CAP1206]
C65  100uF  CAPACITOR-1206  [CAP1206]
C66  100nF  CAPACITOR-0603  [CAP0603]
C67  1uF  CAPACITOR-0603  [CAP0603]
C68  4.7uF  CAPACITOR-0603  [CAP0603]
C69  22uF  CAPACITOR-1206  [CAP1206]
C70  1uF  CAPACITOR-0603  [CAP0603]
C71  100nF  CAPACITOR-0603  [CAP0603]
C72  1uF  CAPACITOR-0603  [CAP0603]
C73  470pF  CAPACITOR-0603  [CAP0603]
C74  1uF  CAPACITOR-0603  [CAP0603]
C75  10nF  CAPACITOR-0603  [CAP0603]
C76  100nF  CAPACITOR-0603  [CAP0603]
C77  10pF  CAPACITOR-0603  [CAP0603]
C78  1uF  CAPACITOR-0603  [CAP0603]
C79  1uF  CAPACITOR-0603  [CAP0603]
C80  22uF  CAPACITOR-1206  [CAP1206]
C81  1uF  CAPACITOR-0603  [CAP0603]
C82  1uF  CAPACITOR-0603  [CAP0603]
C83  22uF  CAPACITOR-1206  [CAP1206]
C84  100nF  CAPACITOR-0603  [CAP0603]
C85  10uF  CAPACITOR-1206  [CAP1206]
CON1  2EDG-2P  [2EDG-2P]
D4  LED0603  [0603]
D5  SMAJ24A  [DO214AC]
F1  2.6A Hold  PTC1206  [1206]
L12  2.2uH  INDUCTOR-2.5X2X1.2MM  [IND2520]
L13  4.7uH  INDUCTOR-6X6MM  [IND0606]
L14  4.7uH  INDUCTOR-6X6MM  [IND0606]
Q1  AO3400  [SOT23]
Q2  AO3401  [SOT23]
R16  147K Ohms  RESISTOR-0603  [RES0603]
R17  21K Ohms  RESISTOR-0603  [RES0603]
R18  147K Ohms  RESISTOR-0603  [RES0603]
R19  21K Ohms  RESISTOR-0603  [RES0603]
R20  41.2K Ohms  RESISTOR-0603  [RES0603]
R21  100K Ohms  RESISTOR-0603  [RES0603]
R23  309K Ohms  RESISTOR-0603  [RES0603]
R24  71.5K Ohms  RESISTOR-0603  [RES0603]
R25  100K Ohms  RESISTOR-0603  [RES0603]
R26  100K Ohms  RESISTOR-0603  [RES0603]
R27  1M Ohms  RESISTOR-0603  [RES0603]
R28  226K Ohms  RESISTOR-0603  [RES0603]
R29  22 Ohms  RESISTOR-0603  [RES0603]
R30  510 Ohms  RESISTOR-0603  [RES0603]
R31  10K Ohms  RESISTOR-0603  [RES0603]
R32  10K Ohms  RESISTOR-0603  [RES0603]
R33  3.9K Ohms  RESISTOR-0603  [RES0603]
R34  100K Ohms  RESISTOR-0603  [RES0603]
R35  210K Ohms  RESISTOR-0603  [RES0603]
R36  64.9K Ohms  RESISTOR-0603  [RES0603]
R37  41.2K Ohms  RESISTOR-0603  [RES0603]
R38  100K Ohms  RESISTOR-0603  [RES0603]
R39  1M Ohms  RESISTOR-0603  [RES0603]
R40  86.6K Ohms  RESISTOR-0603  [RES0603]
U9  MIC23155  [DFN10]
U10  LT8636  [QFN20_ASYM_CORNER]
U11  ADP3334  [LFCSP8_3X3]
U12  LT8636  [QFN20_ASYM_CORNER]
U13  ADP150UJZ-3.3  [SOT23-5]
U14  ADP150UJZ-3.3  [SOT23-5]

### Nets
3V3: C60.1(C1) C64.1(C1) L12.2 R21.2 R23.2 R34.2 R38.2 U9.3(SNS) ; also sheet 1,2
3V3_ANA_MIXER_CLEAN: C81.1(C1) U13.5(OUT) ; also sheet 3
3V3_ANA_PLL_CLEAN: C82.1(C1) U14.5(OUT) ; also sheet 2
3V3_FB: R23.1 R24.2 U9.4(FB)
3V3_SOFTSTART: C55.1(C1) U9.6(SS)
3V3_SW: L12.1 U9.1(SW)
5V0: C50.1(C1) C52.1(C1) C62.1(C1) C65.1(C1) C66.1(C1) C67.1(C1) C78.1(C1) C79.1(C1) L13.2 R25.2 R27.2 R30.2 U9.2(EN) U9.8(VIN) U9.9(VIN) U10.2(BIAS) U11.7(IN) U11.8(IN) U11.9(IN) U13.1(VIN) U13.3(EN) U14.1(VIN) U14.3(EN)
5V0_ANA_PA_CLEAN: C73.1(C1) R35.2 U11.1(OUT) U11.2(OUT) ; also sheet 4
5V0_BST: C61.2(C2) U10.7(BST)
5V0_FB: C62.2(C2) R27.1 R28.2 U10.19(FB) U10.20(FB)
5V0_INTVCC: C57.1(C1) U10.3(INTVCC) U10.15(SYNC/MODE)
5V0_PGOOD: R21.1 U10.1(PG) ; also sheet 1
5V0_RT: R20.2 U10.17(RT)
5V0_SS: C58.1(C1) U10.18(TR/SS)
5V0_SW: C61.1(C1) L13.1 U10.8(SW) U10.9(SW) U10.10(SW)
5V0_VSENSE: C63.1(C1) R25.1 R26.2 ; also sheet 1
12V0: C77.1(C1) C80.1(C1) C83.1(C1) C84.1(C1) L14.2 Q2.2(S) R18.2 R32.2 R39.2 U12.2(BIAS)
12V0_ANA_PA_CLEAN: C69.1(C1) C71.1(C1) Q2.3(D) ; also sheet 4
12V0_BST: C76.2(C2) U12.7(BST)
12V0_FB: C77.2(C2) R39.1 R40.2 U12.19(FB) U12.20(FB)
12V0_INTVCC: C74.1(C1) U12.3(INTVCC) U12.15(SYNC/MODE)
12V0_PA_BIAS_EN: R29.2 ; also sheet 1
12V0_PGOOD: R38.1 U12.1(PG) ; also sheet 1
12V0_RT: R37.2 U12.17(RT)
12V0_SS: C75.1(C1) U12.18(TR/SS)
12V0_SW: C76.1(C1) L14.1 U12.8(SW) U12.9(SW) U12.10(SW)
12V0_VSENSE: C59.1(C1) R18.1 R19.2 ; also sheet 1
!5V0_PA_BIAS_EN: R34.1 U11.6(SD) ; also sheet 1
GND: C50.2(C2) C51.2(C2) C52.2(C2) C53.2(C2) C54.2(C2) C55.2(C2) C56.2(C2) C57.2(C2) C58.2(C2) C59.2(C2) C60.2(C2) C63.2(C2) C64.2(C2) C65.2(C2) C66.2(C2) C67.2(C2) C68.2(C2) C69.2(C2) C70.2(C2) C71.2(C2) C72.2(C2) C74.2(C2) C75.2(C2) C78.2(C2) C79.2(C2) C80.2(C2) C81.2(C2) C82.2(C2) C83.2(C2) C84.2(C2) C85.2(C2) CON1.P$1 D4.C D5.A Q1.2(S) R17.1 R19.1 R20.1 R24.1 R26.1 R28.1 R31.1 R36.1 R37.1 R40.1 U9.7(AGND) U9.10(PGND) U9.11(PGND) U10.4(GND) U10.5(GND) U10.12(GND) U10.13(GND) U10.21(GND) U10.M1(GND) U10.M2(GND) U10.M3(GND) U10.M4(GND) U11.5(GND) U12.4(GND) U12.5(GND) U12.12(GND) U12.13(GND) U12.21(GND) U12.M1(GND) U12.M2(GND) U12.M3(GND) U12.M4(GND) U13.2(GND) U14.2(GND) ; also sheet 1,2,3,4
N$2: Q1.1(G) R29.1 R31.2
N$3: Q2.1(G) R32.1 R33.2
N$5: Q1.3(D) R33.1
N$19: CON1.P$2 F1.2
N$20: C73.2(C2) R35.1 R36.2 U11.3(FB)
N$149: D4.A R30.1
VIN: C51.1(C1) C54.1(C1) C56.1(C1) C68.1(C1) C70.1(C1) C72.1(C1) C85.1(C1) D5.C F1.1 R16.2 U10.6(VIN) U10.11(VIN) U10.14(EN/UV) U12.6(VIN) U12.11(VIN) U12.14(EN/UV)
VIN_VSENSE: C53.1(C1) R16.1 R17.2 ; also sheet 1
Unconnected: U9.5(PG) U10.16(CLKOUT) U12.16(CLKOUT)

### Notes on the sheet
- Vout = ((R27/R28) + 1) * 0.97 | Vout = ((R39/R40) + 1) * 0.97
- f = 1 MHz
  DS. Eq. 3 & Table 1
- f = 1 MHz
  DS. Eq. 3 & Table 1
- VGSon = -8.7V

## Library data of the parts
C1-C41 C43-C50 C52 C53 C55 C57-C67 C71 C73-C79 C81 C82 C84 C86-C88 = Capacitor:CAPACITOR
C42 C69 C80 C83 = Capacitor:CAPACITOR; VOLTAGE: 25V
C51 C68 = Capacitor:CAPACITOR; VOLTAGE: 35V
C54 C56 C70 C72 C85 = Capacitor:CAPACITOR; VOLTAGE: 50V
CON1 = Generic Connector:2EDG-2P
D1 = LED:LED; COLOR: BLUE
D2 D3 = LED:LED; COLOR: RED
D4 = LED:LED; COLOR: GREEN
D5 = TVS:SMAJ*A: SMAJ Series TVS Diodes Source: http://www.littelfuse.com/~/media/electronics/datasheets/tvs_diodes/littelfuse_tvs_diode_smaj_datasheet.pdf.pdf; MF: Littelfuse; MPN: SMAJ24A; OC_FARNELL: 1886345; OC_NEWARK: 06R1865
F1 = PTC Fuses:PTC; HOLD: 3A; OCLCSC: C207041; TRIP: 6A
JP1 = Pin Header:PINHD-1X3: PIN HEADER
L1 = Inductor:INDUCTOR; OCLCSC: C281111
L2-L11 = Inductor:INDUCTOR
L12 = Inductor:INDUCTOR; CURRENT: 2.2A; OCLCSC: C375952
L13 L14 = Inductor:INDUCTOR; CURRENT: 3A; OCLCSC: C326336
LOGO1 = Silkscreen:JS
Q1 = Alpha Omega:AO3400
Q2 = Alpha Omega:AO3401
R1-R21 R23-R41 = Resistor:RESISTOR
RFCON1 RFCON2 = RF Connector:RFCON
TC1 = TagConnect:TC2050-IDC
TP1 = PADs:TESTPOINT
U1 = EFM32:EFM32PG1B200F*M32
U2 = Crystal:DSB321SDA
U3 = Analog Devices:ADF4351
U4 = Maxim Integrated:MAX2671
U5 = Generic Filter:2450BP15E0100
U6 U7 = Analog Devices:ADL5?
U8 = Analog Devices:ADPA9002
U9 = Microchip:MIC23155
U10 U12 = Analog Devices:LT8636
U11 = Analog Devices:ADP3334
U13 U14 = Analog Devices:ADP150*

## Board
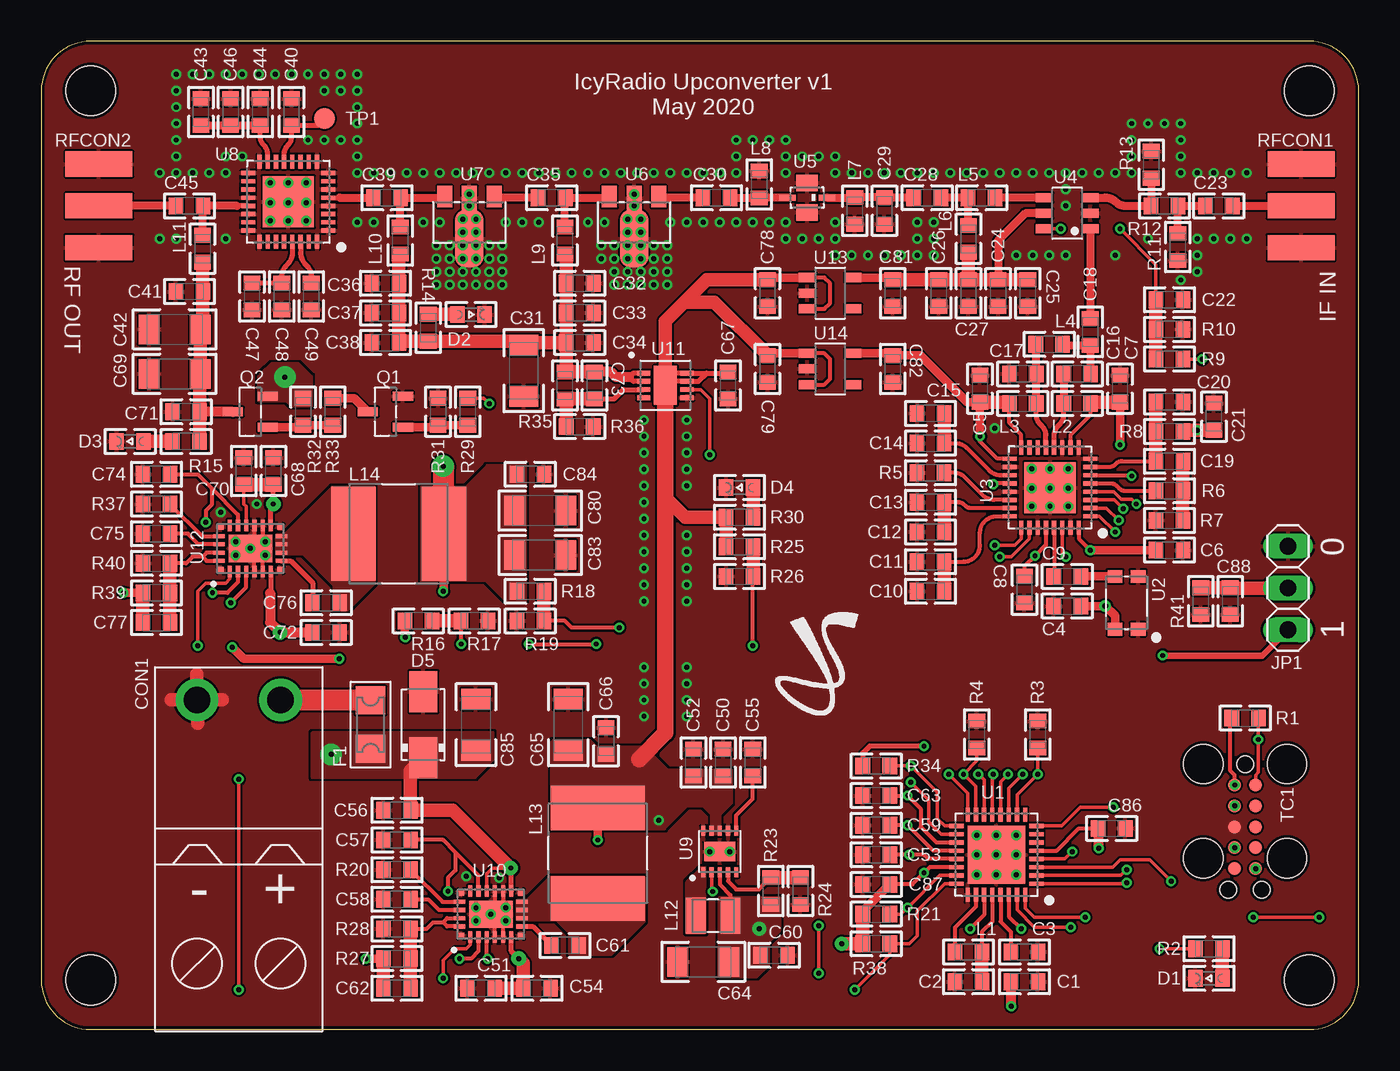
[diagram p10: board, top side]
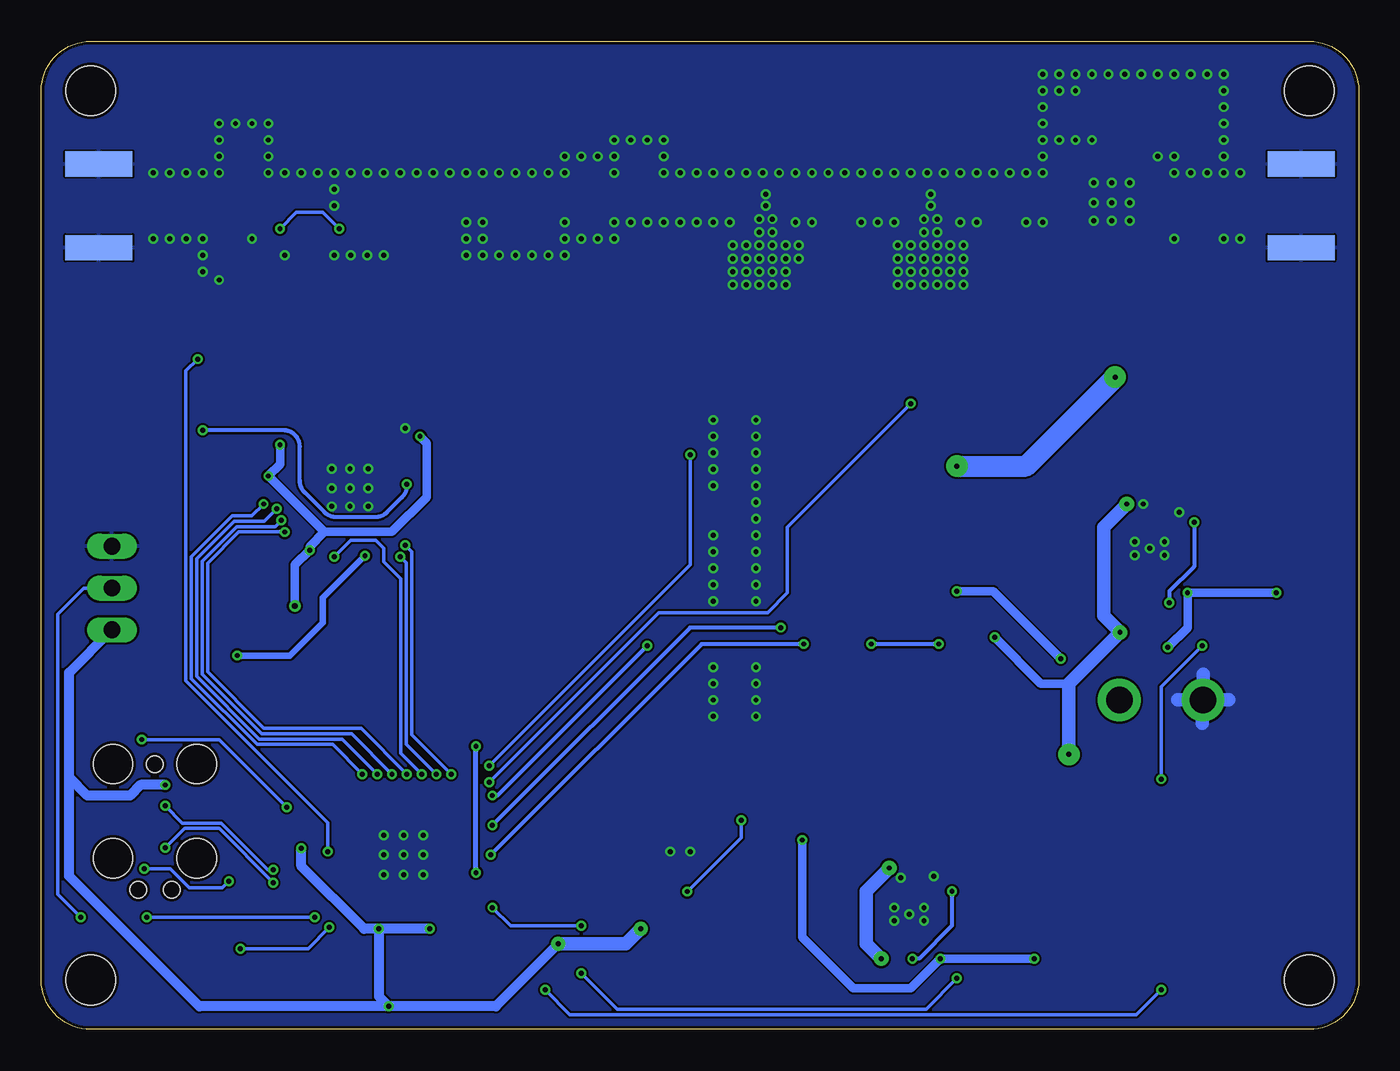
[diagram p11: board, bottom side, seen from below]

Size 80 x 60 mm. Coordinates in mm from the lower left corner, seen from the top.
Outline: 0,57 0,3 arc90 3,0 77,0 arc90 80,3 80,57 arc90 77,60 3,60 arc90 0,57
Copper layers (1*16): Top 0.035mm / dielectric 1.6mm / Bottom 0.035mm
Design rules "jlcpcb_2layer": minimum track width 5mil, minimum drill 0.3mm, track to track 5mil, track to pad 5mil, pad to pad 5mil, via to via 5mil, smd to smd 5mil, copper to edge 0.2mm, drill to drill 5mil, minimum pad ring 3mil, minimum via ring 3mil, stop-mask expansion 0.075mm, vias tented up to drill 10mm, thermal gap 5mil
Holes 3 mm at 3,57 77,57 77,3 3,3
tKeepout: area 0.5,54.5 to 5.5,59.5; area 74.5,54.5 to 79.5,59.5; area 74.5,0.5 to 79.5,5.5; area 0.5,0.5 to 5.5,5.5

### Footprints (pad centres in the part's own frame; a part is rotated, then mirrored left to right if it is on the bottom)
CAP0603 = smd 0.889 x 1.016: 1 -0.819,0; 2 0.819,0
CAP1206 = smd 1.27 x 1.778: 1 -1.549,0; 2 1.549,0
2EDG-2P = drill 1.6 pad 2.6: P$1 -2.54,0; P$2 2.54,0
0603 = smd 0.889 x 1.016: A 0.819,0; C -0.819,0
DO214AC = smd 2.5 x 1.7: A 2,0; C -2,0
1206 = smd 1.7 x 1.803: 1 -1.472,0; 2 1.472,0
1X03 = drill 1.016 long: 1 -2.54,0; 2 0,0; 3 2.54,0
IND0603 = smd 0.889 x 1.016: 1 -0.819,0; 2 0.819,0
IND2520 = smd 2.2 x 1.2: 1 0,-1.05; 2 0,1.05
IND0606 = smd 2.7 x 5.7: 1 -2.75,0; 2 2.75,0
SOT23 = smd 1.219 x 0.533: 1 -1.067,0.94; 2 -1.067,-0.94; 3 1.067,0
RES0603 = smd 0.889 x 1.016: 1 -0.819,0; 2 0.819,0
SMA-EDGE = smd 1.524 x 4.064: GND@0 -2.54,0; GND@1 2.54,0; SIG 0,0 | smd 1.524 x 4.064 bottom: GND@2 -2.54,0; GND@3 2.54,0
TC2050-IDC = smd 0.787 x 0.787: 1 -2.54,-0.635; 2 -1.27,-0.635; 3 0,-0.635; 4 1.27,-0.635; 5 2.54,-0.635; 6 2.54,0.635; 7 1.27,0.635; 8 0,0.635; 9 -1.27,0.635; 10 -2.54,0.635 | hole 0.991: -3.81,0; 3.81,1.016; 3.81,-1.016 | hole 2.375: -3.81,2.54; -3.81,-2.54; 1.905,2.54; 1.905,-2.54
PAD1.27MM = smd 1.27 x 1.27: TP 0,0
QFN32_0.5P_JPG = smd 0.86 x 0.26: 1 -2.43,1.75; 2 -2.43,1.25; 3 -2.43,0.75; 4 -2.43,0.25; 5 -2.43,-0.25; 6 -2.43,-0.75; 7 -2.43,-1.25; 8 -2.43,-1.75; 17 2.43,-1.75; 18 2.43,-1.25; 19 2.43,-0.75; 20 2.43,-0.25; 21 2.43,0.25; 22 2.43,0.75; 23 2.43,1.25; 24 2.43,1.75 | smd 0.26 x 0.86: 9 -1.75,-2.43; 10 -1.25,-2.43; 11 -0.75,-2.43; 12 -0.25,-2.43; 13 0.25,-2.43; 14 0.75,-2.43; 15 1.25,-2.43; 16 1.75,-2.43; 25 1.75,2.43; 26 1.25,2.43; 27 0.75,2.43; 28 0.25,2.43; 29 -0.25,2.43; 30 -0.75,2.43; 31 -1.25,2.43; 32 -1.75,2.43 | smd 3.5 x 3.5: 33 0,0
TCXO-3225 = smd 0.78 x 0.9: 1 -1.6,-0.7; 2 1.6,-0.7; 3 1.6,0.7; 4 -1.6,0.7
QFN32 = smd 0.86 x 0.26: 1 -2.435,1.75; 2 -2.435,1.25; 3 -2.435,0.75; 4 -2.435,0.25; 5 -2.435,-0.25; 6 -2.435,-0.75; 7 -2.435,-1.25; 8 -2.435,-1.75; 17 2.435,-1.75; 18 2.435,-1.25; 19 2.435,-0.75; 20 2.435,-0.25; 21 2.435,0.25; 22 2.435,0.75; 23 2.435,1.25; 24 2.435,1.75 | smd 0.26 x 0.86: 9 -1.75,-2.435; 10 -1.25,-2.435; 11 -0.75,-2.435; 12 -0.25,-2.435; 13 0.25,-2.435; 14 0.75,-2.435; 15 1.25,-2.435; 16 1.75,-2.435; 25 1.75,2.435; 26 1.25,2.435; 27 0.75,2.435; 28 0.25,2.435; 29 -0.25,2.435; 30 -0.75,2.435; 31 -1.25,2.435; 32 -1.75,2.435 | smd 3.1 x 3.1: 33 0,0
SOT23-6 = smd 1 x 0.55: 1 -1.4,0.95; 2 -1.4,0; 3 -1.4,-0.95; 4 1.4,-0.95; 5 1.4,0; 6 1.4,0.95
2450BP15E0100 = smd 1.3 x 1: 1 0,0.9; 3 0,-0.9 | smd 1 x 0.35: 2 1.2,0; 4 -1.2,0
SOT89 = smd 0.9 x 1.3: 1 -1.5,-1.562; 3 1.5,-1.562 | smd 0.9 x 1.5: 2 0,-1.462 | smd 1.733 x 3.5: 4 0,0.988
DFN10 = smd 0.6 x 0.25: 1 -1.25,1; 2 -1.25,0.5; 3 -1.25,0; 4 -1.25,-0.5; 5 -1.25,-1; 6 1.25,-1; 7 1.25,-0.5; 8 1.25,0; 9 1.25,0.5; 10 1.25,1 | smd 1.2 x 1.9: 11 0,0
QFN20_ASYM_CORNER = smd 0.7 x 0.25: 1 -1.4,1.25; 2 -1.4,0.75; 3 -1.4,0.25; 4 -1.4,-0.25; 5 -1.4,-0.75; 6 -1.4,-1.25; 11 1.4,-1.25; 12 1.4,-0.75; 13 1.4,-0.25; 14 1.4,0.25; 15 1.4,0.75; 16 1.4,1.25 | smd 0.25 x 0.7: 7 -0.75,-1.9; 8 -0.25,-1.9; 9 0.25,-1.9; 10 0.75,-1.9; 17 0.75,1.9; 18 0.25,1.9; 19 -0.25,1.9; 20 -0.75,1.9 | smd 1.65 x 2.65: 21 0,0 | smd 0.375 x 0.375: M1 -1.312,1.812; M2 1.312,1.812; M3 -1.312,-1.812; M4 1.312,-1.812
LFCSP8_3X3 = smd 0.8 x 0.3: 1 -1.315,0.75; 2 -1.315,0.25; 3 -1.315,-0.25; 4 -1.315,-0.75; 5 1.315,-0.75; 6 1.315,-0.25; 7 1.315,0.25; 8 1.315,0.75 | smd 1.4 x 2.36: 9 0,0
SOT23-5 = smd 1 x 0.55: 1 -1.4,0.95; 2 -1.4,0; 3 -1.4,-0.95; 4 1.4,-0.95; 5 1.4,0.95

### Placement (x,y rotation side)
C1  59.7,2.9 0 top
C2  56.3,2.9 180 top
C3  59.7,4.7 0 top
C4  62.3,25.7 180 top
C5  57,38.9 90 top
C6  68.5,29.1 0 top
C7  65.5,38.9 90 top
C8  59.7,26.7 270 top
C9  62.3,27.5 180 top
C10  54,26.6 180 top
C11  54,28.4 180 top
C12  54,30.2 180 top
C13  54,32 180 top
C14  54,35.6 180 top
C15  54,37.4 180 top
C16  62.9,39.8 0 top
C17  59.6,39.8 180 top
C18  63.7,42.35 90 top
C19  68.5,34.5 0 top
C20  68.5,38.1 0 top
C21  71.2,37.2 90 top
C22  68.5,44.3 0 top
C23  71.5,50 180 top
C24  58.1,44.7 270 top
C25  59.9,44.7 270 top
C26  54.5,44.7 270 top
C27  56.3,44.7 270 top
C28  53.8,50.5 180 top
C29  51.2,49.7 270 top
C30  41,50.5 180 top
C31  29.3,40 270 top
C32  32.7,45.3 0 top
C33  32.7,43.5 0 top
C34  32.7,41.7 0 top
C35  31,50.5 180 top
C36  20.9,45.3 180 top
C37  20.9,43.5 180 top
C38  20.9,41.7 180 top
C39  21,50.5 180 top
C40  15.2,55.7 90 top
C41  9,44.8 180 top
C42  8.1,42.5 180 top
C43  9.7,55.7 90 top
C44  13.3,55.7 90 top
C45  9,50 180 top
C46  11.5,55.7 90 top
C47  12.8,44.5 270 top
C48  14.6,44.5 270 top
C49  16.4,44.5 270 top
C50  41.4,16.2 90 top
C51  26.7,2.5 180 top
C52  39.6,16.2 90 top
C53  50.7,10.6 180 top
C54  30.1,2.5 0 top
C55  43.2,16.2 90 top
C56  21.6,13.3 180 top
C57  21.6,11.5 180 top
C58  21.6,7.9 180 top
C59  50.7,12.4 180 top
C60  44.5,4.5 0 top
C61  31.8,5.1 180 top
C62  21.6,2.5 0 top
C63  50.7,14.2 180 top
C64  40.2,4.1 180 top
C65  32,18.5 90 top
C66  34.3,17.5 90 top
C67  41.7,39.1 270 top
C68  14.1,33.9 90 top
C69  8.1,39.8 180 top
C70  12.3,33.9 90 top
C71  8.8,37.5 180 top
C72  17.3,24.1 0 top
C73  33.6,39.1 270 top
C74  7,33.7 180 top
C75  7,30.1 180 top
C76  17.3,25.9 180 top
C77  7,24.7 0 top
C78  44.1,44.7 270 top
C79  44.1,40.1 270 top
C80  30.3,31.5 0 top
C81  51.7,44.7 270 top
C82  51.7,40.1 270 top
C83  30.3,28.8 0 top
C84  29.7,33.7 0 top
C85  26.4,18.5 90 top
C86  65,12.2 0 top
C87  50.7,8.8 180 top
C88  72.2,26 270 top
CON1  12,20 0 top
D1  70.9,3.1 0 top
D2  26.1,43.4 180 top
D3  5.4,35.7 0 top
D4  42.4,32.9 0 top
D5  23.2,18.5 90 top
F1  20,18.5 90 top
JP1  75.7,26.8 90 top
L1  56.3,4.7 180 top
L2  62.9,38 180 top
L3  59.6,38 180 top
L4  61.2,41.6 180 top
L5  57.1,50.5 180 top
L6  56.3,48 270 top
L7  49.4,49.7 270 top
L8  43.6,51.3 90 top
L9  31.8,47.9 270 top
L10  21.8,47.9 270 top
L11  9.8,47.4 270 top
L12  40.8,6.9 270 top
L13  33.8,10.7 90 top
L14  21.7,30.1 0 top
LOGO1  49.8,25.5 0 top
Q1  20.9,37.5 180 top
Q2  12.7,37.5 180 top
R1  73.1,18.9 180 top
R2  70.9,4.9 180 top
R3  60.5,17.9 270 top
R4  56.8,17.9 270 top
R5  54,33.8 0 top
R6  68.5,32.7 180 top
R7  68.5,30.9 0 top
R8  68.5,36.3 180 top
R9  68.5,40.7 0 top
R10  68.5,42.5 180 top
R11  69,47.5 90 top
R12  68.2,50 0 top
R13  67.4,52.5 270 top
R14  23.5,42.6 270 top
R15  8.8,35.7 0 top
R16  22.9,24.8 180 top
R17  26.3,24.8 180 top
R18  29.7,26.6 180 top
R19  29.7,24.8 0 top
R20  21.6,9.7 0 top
R21  50.7,7 180 top
R23  44.3,8.4 270 top
R24  46.1,8.4 90 top
R25  42.4,29.3 180 top
R26  42.4,27.5 0 top
R27  21.6,4.3 180 top
R28  21.6,6.1 0 top
R29  25.9,37.5 90 top
R30  42.4,31.1 180 top
R31  24.1,37.5 270 top
R32  15.9,37.5 90 top
R33  17.7,37.5 270 top
R34  50.7,16 180 top
R35  31.8,39.1 90 top
R36  32.7,36.6 180 top
R37  7,31.9 0 top
R38  50.7,5.2 180 top
R39  7,26.5 180 top
R40  7,28.3 0 top
R41  70.4,26 90 top
RFCON1  76.5,50 90 top
RFCON2  3.5,50 90 top
TC1  73.1,12.3 270 top
TP1  17.2,55.3 0 top
U1  58,10.6 180 top
U2  65.9,25.9 90 top
U3  61.25,32.9 180 top
U4  62.3,49.55 180 top
U5  46.5,50.5 180 top
U6  36,49 180 top
U7  26,49 180 top
U8  15,50.25 180 top
U9  41.2,10.8 90 top
U10  27.3,7 90 top
U11  37.9,39.1 0 top
U12  12.7,29.2 90 top
U13  47.9,44.7 0 top
U14  47.9,40.1 0 top

### Tracks (layer width: path | path; a pad name or v marks a point on that pad's centre or on a via)
1V8
  Top 0.254: U1.28 57.75,6.55 57.12,5.92 L1.1
  Top 0.813: C2.1 L1.1
3V3  (via drill 0.3, 0.3 pad 0.85)
  Top 0.254: U3.28 61,29.42 v60.34,28.76 59.7,28.12 C8.1 | U9.3 41.2,8.8 41.85,8.15 L12.2 | U1.22 53.95,9.85 v53.6,9.5 52.9,8.8 C87.1 | U1.27 57.25,6.95 v56.4,6.1 | U1.30 58.75,6.85 v59.5,6.1 | U1.5 61.65,10.85 63,12.2 C86.1 | v72.47,14.84 72.47,15.44 72.2,15.7 72.2,18.82 R1.2
  Top 0.305: v53.6,17.2 50.3,17.2 49.88,16.78 R34.2
  Top 0.406: v68.1,22.7 74.14,22.7 JP1.1
  Top 0.508: R21.2 49.88,7.16 C87.1
  Top 0.61: v58.9,1.4 58.9,2.88 C1.1 | v64.2,11 64.2,12.18 C86.1
  Top 0.813: v48.6,5.2 R38.2 R21.2
  Bottom 0.305: v53.6,9.5 v53.6,17.2
  Bottom 0.406: v60.34,28.76 62.9,26.2 62.9,24.7 64.9,22.7 v68.1,22.7
  Bottom 0.61: v48.6,5.2 52.4,1.4 v58.9,1.4 | v59.5,6.1 59.5,2 v58.9,1.4 | v56.4,6.1 v59.5,6.1 | v58.9,1.4 70.4,1.4 78.3,9.3 78.3,15.3 | JP1.1 78.3,21.66 78.3,15.3 | v59.5,6.1 60.4,6.1 64.2,9.9 v64.2,11 | v72.47,14.84 73.96,14.84 74.6,14.2 77.2,14.2 78.3,15.3
  Bottom 0.813: v48.6,5.2 44.5,5.2 v43.6,6.1
  pour Top (no thermals): 41.2,8 44.8,8 44.8,6 44.1,5.3 44.1,3.9 43.4,3.2 41.2,3.2
3V3_ANA_MIXER_CLEAN
  Top 0.5: U4.5 59.75,49.55 58.1,47.9 C24.1
  Top 0.508: U13.5 51.57,45.65 C81.1
  Top 0.813: C25.1 C24.1 C27.1 | C27.1 C26.1 C81.1 | L6.2 C27.1
3V3_ANA_PLL_CLEAN  (via drill 0.3, 0.35)
  Top 0.254: U3.16 59.5,36.1 58.78,36.82 L3.2 | U3.10 62.5,36.1 63.72,37.32 L2.1 | U3.6 66.15,33.65 v66.2,33.6 | U3.32 63,29.8 v63.7,29.1 | U3.17 58.05,34.65 57,35.7 v57,36
  Top 0.508: U14.5 51.57,41.05 C82.1 53.38,40.92 56.22,38.08 C5.1 v57,36 | v63.7,29.1 C6.1 | v65.5,35.5 C7.1 | U2.4 65.2,25.1 v64.6,25.7 C4.1
  Top 0.813: C7.1 63.8,38.08 L2.1 | C5.1 58.7,38.08 L3.2
  Bottom 0.508: v57,36 56.6,35.6 56.6,32.3 58.7,30.2 62.8,30.2 | v65.5,35.5 65.5,34.3 v66.2,33.6 62.8,30.2 | v64.6,25.7 64.6,28.2 v63.7,29.1 63.7,29.3 62.8,30.2
3V3_FB
  Top 0.254: U9.4 41.7,9 42.2,8.5 43.58,8.5 R23.1
  Top 0.813: R23.1 R24.2
3V3_SOFTSTART
  Top 0.254: U9.6 42.2,13 43.2,14 C55.1
3V3_SW
  pour Top (no thermals): 40.1,9.8 39.2,8.9 39.2,5.9 40.3,5.9 40.3,9.8
5V0  (via drill 0.3)
  Top 0.2: U9.2 40.7,8.45 v40.77,8.37
  Top 0.254: U13.3 47.55,43.75 47.9,44.1 47.9,45.3 47.55,45.65 U13.1 | U14.3 47.55,39.15 47.9,39.5 47.9,40.7 47.55,41.05 U14.1 | U10.2 26.55,4.75 26.1,4.3 v25.4,4.3
  Top 0.305: 38.15,39.35 U11.7 39.9,39.35 40.4,39.85 | 38.15,39.35 U11.9 | 38.15,39.35 38.15,39.85 38.2,39.9 38.25,39.85 U11.8 40.4,39.85 | 40.4,39.85 41.63,39.85 C67.1
  Top 0.508: U14.1 44.23,41.05 C79.1 | U13.1 44.23,45.65 C78.1 | R27.2 v19.7,4.3 | v33.8,11.5 L13.2
  Top 0.813: C62.1 R27.2 | U11.9 37.9,43 39.05,44.15 | C78.1 40.42,45.52 39.05,44.15 | 37.9,32.3 39.1,31.1 R30.2 R25.2 | C79.1 40.87,44.15 39.05,44.15
  Top 1.016: U11.9 37.9,32.3 37.9,18 36.3,16.4
  Bottom 0.2: v40.77,8.37 37.5,11.65 v37.5,12.7
  Bottom 0.508: v19.7,4.3 v25.4,4.3 27.2,2.5 30.7,2.5 33.8,5.6 v33.8,11.5
  pour Top (no thermals): 31,12.2 37.8,12.2 39.2,13.6 40.2,13.6 40.7,13.1 40.7,11.9 41.2,11.9 41.2,13.1 41.9,13.8 41.9,15.7 38,15.7 36.6,17.1 33.7,17.1 33.3,17.5 31.1,17.5 31,17.4
5V0_ANA_PA_CLEAN
  Top 0.305: U11.2 35.95,39.35 35.7,39.6 35.95,39.85 U11.1
  Top 0.61: 35.7,39.6 34.9,39.6 34.58,39.92 C73.1
  Top 0.813: C73.1 R35.2 31.88,40 C34.1 | C34.1 29.45,41.7 C31.1 29.07,41.78 R14.2 21.8,41.78 C38.1 C37.1 C36.1 21.72,47 L10.2 | C34.1 C33.1 C32.1 31.88,47 L9.2
5V0_BST
  Top 0.305: U10.7 29.83,6.25 C61.2
5V0_FB
  Top 0.254: U10.20 24.65,6.25 24.4,6.5 | 24.4,6.5 24.65,6.75 U10.19 | R28.2 23.4,6.1 23.8,6.5 24.4,6.5
  Top 0.813: C62.2 R27.1 R28.2
5V0_INTVCC  (via drill 0.3)
  Top 0.254: U10.15 26.55,9.35 25.15,10.75 | C57.1 24.4,11.5 25.15,10.75 | 25.15,10.75 25.15,9.65 24.7,9.2 v24.7,8.4 | v27.1,4.3 27.05,4.35 U10.3
  Bottom 0.254: v24.7,8.4 24.7,6.3 26.7,4.3 v27.1,4.3
5V0_PGOOD  (via drill 0.3)
  Top 0.2: U10.1 26.05,5.15 25.8,4.9 25.1,4.9 24.4,4.2 v24.4,3.1 | U1.23 54.55,9.35 v52.6,7.4 52.2,7 R21.1 | v47.2,3.4 v47.2,6.3
  Bottom 0.2: v24.4,3.1 26.27,1.23 45.03,1.23 v47.2,3.4 | v47.2,6.3 51.5,6.3 v52.6,7.4
5V0_RT
  Top 0.254: R20.2 24.37,7.75 U10.17
5V0_SS
  Top 0.254: C58.1 23.5,7.9 24.15,7.25 U10.18
5V0_SW
  pour Top (no thermals): 28.9,6.7 31.3,6.7 32.1,5.9 32.1,4.6 34.6,4.6 36.6,6.6 36.6,9.2 30.9,9.2 29.5,7.8 28.9,7.8
5V0_VSENSE  (via drill 0.3)
  Top 0.254: U1.19 54.35,11.35 53.4,12.3 53.4,13.4 v52.6,14.2 C63.1 51.52,14.18 | v43.2,23.3 43.2,27.48 R26.2
  Top 0.813: R25.1 R26.2
  Bottom 0.254: v52.6,14.2 52.3,14.2 v43.2,23.3
12V0  (via drill 0.3, 0.3 pad 1.3)
  Top 0.254: U12.2 11.95,27.15 11.3,26.5 v10.4,26.5
  Top 0.508: R39.2 v5,26.5 | L14.2 24.45,26.65 v24.4,26.6 | v18.1,22.5 12.3,22.5 v11.6,23.2
  Top 0.813: C77.1 R39.2
  Top 1.27: L14.2 24.45,34.15 v24.4,34.2
  Bottom 0.508: v5,26.5 v10.4,26.5 10.4,24.4 v11.6,23.2 | v24.4,26.6 22.2,26.6 v18.1,22.5
  Bottom 1.27: v24.4,34.2 20.2,34.2 v14.8,39.6
  pour Top (no thermals): 23.1,27.3 27,27.3 28.2,26.1 29.4,26.1 29.4,34.2 27.1,34.2 25.8,32.9 23.1,32.9
  pour Top (no thermals): 13.2,38.2 14.9,38.2 15.2,37.9 16.4,37.9 16.4,39.6 15.6,40.4 14,40.4 13.4,39.8 13.2,39.6
12V0_ANA_PA_CLEAN
  Top 0.61: Q2.3 C71.1
  Top 0.813: L11.2 9.8,44.82 C41.1 9.82,42.67 C42.1 C69.1 9.62,39.77 C71.1 R15.2
12V0_BST
  Top 0.305: U12.7 15.15,28.45 16.48,27.12 C76.2
12V0_FB
  Top 0.254: U12.19 10.05,28.95 9.8,28.7 | 9.8,28.7 10.05,28.45 U12.20 | 9.8,28.7 9.2,28.7 8.8,28.3 R40.2
  Top 0.813: C77.2 R39.1 R40.2
12V0_INTVCC  (via drill 0.3)
  Top 0.254: U12.15 11.95,31.25 10.35,32.85 | C74.1 9.5,33.7 10.35,32.85 | v11.5,25.9 12.45,26.85 U12.3 | 10.35,32.85 10.35,31.85 10,31.5 v10,30.8
  Bottom 0.254: v10,30.8 10,28.1 11.5,26.6 v11.5,25.9
12V0_PA_BIAS_EN  (via drill 0.3)
  Top 0.2: U1.18 54.65,11.85 53.9,12.6 53.9,13.9 v52.8,15 | R29.2 26.88,38.32 v27.2,38
  Bottom 0.2: v27.2,38 34.7,30.5 34.7,26.5 35.9,25.3 42.5,25.3 v52.8,15
12V0_PGOOD  (via drill 0.3)
  Top 0.2: U12.1 11.45,27.35 11.2,27.1 10,27.1 9.5,26.6 v9.5,23.3 | v12,15.2 v12,2.4 | U1.24 54.85,8.85 53.2,7.2 53.2,5.7 52.7,5.2 R38.1 51.52,4.52 v49.4,2.4
  Bottom 0.2: v9.5,23.3 12,20.8 v12,15.2 | v12,2.4 13.5,0.9 47.9,0.9 v49.4,2.4
12V0_RT
  Top 0.254: R37.2 9.77,29.95 U12.17
12V0_SS
  Top 0.254: U12.18 9.55,29.45 8.9,30.1 C75.1
12V0_SW
  pour Top (no thermals): 14.3,28.9 15.9,28.9 17.8,27 17.8,25.5 18.6,25.5 20.2,27.1 20.2,32.9 17.7,32.9 14.8,30 14.3,30
12V0_VSENSE  (via drill 0.3)
  Top 0.254: U1.20 54.15,10.85 v52.6,12.4 C59.1 | 35.02,24.4 v35.1,24.4 32.2,24.4 31.8,24.8 R19.2
  Top 0.813: R19.2 R18.1
  Bottom 0.254: v35.1,24.4 40.6,24.4 v52.6,12.4
!5V0_PA_BIAS_EN  (via drill 0.3)
  Top 0.2: R34.1 v52.8,16 54.4,14.4 54.4,12.8 54.85,12.35 U1.17 | U11.6 40.05,38.85 40.6,38.3 v40.6,34.9
  Bottom 0.2: v40.6,34.9 40.6,28.2 v52.8,16
!MIXER_SHDN  (via drill 0.3)
  Top 0.2: U1.4 62.15,10.35 v62.6,10.8 | v70.5,40.7 R9.2
  Bottom 0.2: v62.6,10.8 62.6,12.55 71.21,21.16 71.21,39.99 v70.5,40.7
!PLL_MUTE  (via drill 0.3)
  Top 0.2: U1.15 56.75,14.75 v56,15.5 56.8,16.3 R4.2 | U3.26 60,29.8 58.9,28.7 v58.2,28.7
  Bottom 0.2: v56,15.5 57.83,17.33 57.83,28.33 v58.2,28.7
!RESET  (via drill 0.3)
  Top 0.2: U1.8 61.95,12.35 63.1,13.5 v65.1,13.5 | R1.1 73.9,18.88 v73.9,17.6 73.9,15.6 73.73,15.44 TC1.10
  Bottom 0.2: v65.1,13.5 69.2,17.6 v73.9,17.6
GND  (via drill 0.3)
  Top 0.254: U10.13 27.55,7.25 U10.21 27.55,6.75 U10.4 | U10.12 28.05,7.55 v28.2,7.4 | U10.5 28.05,6.45 v28.2,6.6 | U12.5 13.45,28.65 v13.6,28.8 | U12.4 12.95,28.95 U12.21 12.95,29.45 U12.13 | U12.12 13.45,29.75 v13.6,29.6
  Top 0.813: CON1.P$1 7.9,20 | CON1.P$1 9.46,21.56 | CON1.P$1 11,20 | 9.5,19.96 9.5,18.6
  Bottom 0.813: CON1.P$1 7.9,20 | CON1.P$1 9.46,21.56 | CON1.P$1 11,20 | CON1.P$1 9.5,19.96 9.5,18.6
  other vias: 19.2,52 20.2,52 21.2,52 22.2,52 23.2,52 69.2,52 70.2,52 71.2,52 72.2,52 73.2,52 64.2,52 65.2,52 66.2,52 59.2,52 60.2,52 61.2,52 62.2,52 63.2,52 54.2,52 55.2,52 56.2,52 57.2,52 58.2,52 49.2,52 50.2,52 51.2,52 52.2,52 53.2,52 46.2,53 48.2,52 39.2,52 40.2,52 41.2,52 42.2,52 34.2,52 35.2,52 36.2,52 37.2,52 38.2,52 29.2,52 30.2,52 31.2,52 32.2,52 33.2,52 24.2,52 25.2,52 26.2,52 27.2,52 28.2,52 8.2,52 9.2,52 10.2,52 11.2,52 39.2,34 39.2,35 39.2,36 39.2,37 39.2,29 39.2,30 39.2,33 39.2,26 39.2,27 39.2,28 39.2,19 39.2,20 39.2,21 39.2,22 36.6,34 36.6,35 36.6,36 36.6,37 36.6,29 36.6,30 36.6,31 36.6,32 36.6,33 36.6,26 36.6,27 36.6,28 36.6,19 36.6,20 36.6,21 36.6,22 7.2,48 8.2,48 45.2,52 45.2,53 45.2,54 44.2,54 43.2,54 42.2,54 42.2,53 47.2,53 48.2,53 69.2,53 69.2,54 69.2,55 68.2,55 67.2,55 66.2,55 66.2,54 66.2,53 67.2,48 70.2,48 71.2,48 72.2,48 73.2,48 70.2,47 70.2,46 69.2,45.5 19.2,49 20.2,49 23.2,49 39.2,49 40.2,49 41.2,49 42.2,49 34.2,49 38.2,49 29.2,49 30.2,49 33.2,49 24.2,49 26,50.7 28.2,49 48.2,47 43.2,49 45.2,49 44.2,49 45.2,48 46.2,48 47.2,48 48.2,48 48.2,49 49.2,47 50.2,47 51.2,47 52.2,47 53.2,47 53.2,48 53.2,49 54.2,49 54.2,48 54.2,47 59.2,47 60.2,47 61.2,47 62.2,47 65.2,47 11.2,48 7.2,52 19.2,53 19.2,54 18.2,54 17.2,54 16.2,54 19.2,55 19.2,56 19.2,57 19.2,58 18.2,58 18.2,57 17.2,57 17.2,58 16.2,58 15.2,58 14.2,58 13.2,58 12.2,58 11.2,58 10.2,58 9.2,58 8.2,58 8.2,57 8.2,56 8.2,55 8.2,54 8.2,53 11.2,53 12.2,53 26.4,49.2 25.6,49.2 26,50 26.4,46.8 25.6,46.8 26.4,47.6 25.6,47.6 26.4,48.4 25.6,48.4 24.8,46 24.8,45.2 27.2,46 27.2,45.2 26.4,46 26.4,45.2 25.6,46 25.6,45.2 27.2,47.6 27.2,46.8 24.8,47.6 24.8,46.8 24,46 24,45.2 24,47.6 24,46.8 28,46 28,45.2 28,47.6 28,46.8 36,50.7 36.4,49.2 35.6,49.2 36,50 36.4,46.8 35.6,46.8 36.4,47.6 35.6,47.6 36.4,48.4 35.6,48.4 34.8,46 34.8,45.2 37.2,46 37.2,45.2 36.4,46 36.4,45.2 35.6,46 35.6,45.2 37.2,47.6 37.2,46.8 34.8,47.6 34.8,46.8 34,47.6 34,46.8 38,46 38,45.2 38,47.6 38,46.8 16.1,49.1 15,49.1 13.9,49.1 13.9,50.2 15,50.2 13.9,51.4 15,51.4 16.1,51.4 62.35,32.85 62.35,31.75 61.25,31.75 60.15,31.75 60.15,32.85 61.25,32.85 60.15,34.05 61.25,34.05 62.35,34.05 16.1,50.2 12.7,29.2 11.8,29.6 11.8,28.8 27.3,7 26.4,7.4 26.4,6.6 41.8,10.8 40.6,10.8 25.8,9.3 62.2,50 62.2,51 59.2,11.8 58,11.8 56.8,11.8 59.2,9.4 58,9.4 56.8,9.4 59.2,10.6 58,10.6 56.8,10.6 27.8,9.2 13.1,31.9 10.9,31.4 57.9,36.5
  pour Top (rank 6): -2,-2 -2,62 82,62 82,-2
  pour Bottom (rank 6): -4,-4 84,-4 84,64 -4,64
IF_FREQ_SEL  (via drill 0.3)
  Top 0.2: U1.32 59.75,7.35 60.3,6.8 v63.4,6.8 | v73.6,6.8 v77.6,6.8
  Top 0.813: JP1.2 72.22,26.8 C88.1 R41.2
  Bottom 0.2: v63.4,6.8 v73.6,6.8 | v77.6,6.8 79,8.2 79,25.2 77.4,26.8 JP1.2
IF_IN_ACC
  Top 0.5: R13.2 67.4,50.02 R12.1 65.79,50 arc-45 65.29,50.21 arc45 64.59,50.5 U4.3
IF_IN_DCC
  Top 0.5: C23.1 RFCON1.SIG
LED  (via drill 0.3)
  Top 0.2: U1.31 59.25,7.25 60.3,6.2 v62.5,6.2 | v67.9,4.9 R2.2
  Bottom 0.2: v62.5,6.2 63.8,4.9 v67.9,4.9
MIXER_LO
  Top 0.5: U4.1 C18.2
N$1
  Top 0.5: C16.2 63.7,39.82 C18.1 62.09,41.53 L4.1
N$2
  Top 0.508: Q1.1 23.98,36.56 R31.2 R29.1
N$3
  Top 0.508: R33.2 R32.1 15.78,36.56 Q2.1
N$4  (via drill 0.3)
  Top 0.2: v65.5,48.6 67.68,46.42 C22.1 | U4.6 v61.9,48.6
  Top 0.813: C22.1 R10.2 R9.1
  Bottom 0.2: v61.9,48.6 62.9,49.6 64.5,49.6 v65.5,48.6
N$5
  Top 0.508: Q1.3 19.01,38.32 R33.1
N$6
  Top 0.5: C28.1 L5.2 56.28,48.74 56.3,48.76 L6.1
N$7
  Top 0.5: U4.4 L5.1
N$8
  Top 0.3: U8.15 13.75,53.14 arc45 13.53,53.67 13.52,53.68 arc-45 13.3,54.21 C44.1
  Top 0.5: C43.1 C46.1 C44.1
N$9
  Top 0.3: U8.29 15.25,47.16 arc-45 14.96,46.46 14.89,46.39 arc45 14.6,45.69 C48.1 C47.1
N$10
  Top 0.3: U8.30 15.75,47.16 arc45 16.04,46.46 16.11,46.39 arc-45 16.4,45.69 C49.1
N$11
  Top 0.3: U8.13 14.75,53.14 arc-45 14.97,53.67 14.98,53.68 arc45 15.2,54.21 C40.1 16.8,54.88 17.2,55.28 TP1.TP
N$12
  Top 0.5: C30.2 37.56,50.5 U6.1
N$13
  Top 0.3: U8.21 11.9,50
  Top 0.5: 11.9,50 C45.1 9.8,49.98 L11.1
N$14
  Top 0.5: U6.3 34.44,50.5 C35.1 31.8,50.48 L9.1
N$15
  Top 0.5: C35.2 27.56,50.5 U7.1
N$16
  Top 0.5: U7.3 24.44,50.5 C39.1 21.8,50.48 L10.1
N$17
  Top 0.3: U8.5 18.1,50.5
  Top 0.5: 18.1,50.5 C39.2
N$18
  Top 0.5: C45.2 RFCON2.SIG
N$19
  Top 1.27: CON1.P$2 19.97,20 F1.2
N$20
  Top 0.305: C73.2 34.78,38.28 35.35,38.85 U11.3
  Top 0.813: R36.2 31.88,38.2 R35.1 C73.2
N$21
  Top 0.254: U1.26 56.75,7.45 55.48,6.18 L1.2
N$22
  Top 0.254: U1.29 58.25,6.55 58.88,5.92 C3.1
N$23
  Top 0.813: R14.1 25.26,43.42 D2.A
N$24
  Top 0.813: R15.1 D3.A
N$25
  Top 0.813: D1.A R2.1
N$26
  Top 0.5: R11.2 69,49.98 R12.2 C23.2
N$67
  Top 0.3: U3.13 61,36.09 arc45 60.78,36.62 60.64,36.76 arc-45 60.42,37.29 L3.1
  Top 0.5: L3.1 C17.1 60.42,41.56 L4.2
N$69
  Top 0.3: U3.12 61.5,36.09 arc-45 61.72,36.62 61.86,36.76 arc45 62.08,37.29 L2.2
  Top 0.5: C16.1 L2.2
N$84
  Top 0.813: C19.2 R6.1 R7.2
N$88
  Top 0.254: U3.22 57.86,32.15 arc-45 57.16,32.44 56.09,33.51 arc45 55.39,33.8 R5.2
N$149
  Top 0.813: R30.1 D4.A
PLL_CP_VOUT
  Top 0.254: U3.7 64.84,34.15 arc45 65.2,34.3 65.25,34.35 arc-45 65.61,34.5 C19.1
  Top 0.813: C19.1 R8.2 C20.1
PLL_EN  (via drill 0.3)
  Top 0.2: U3.4 65.11,32.65 65.56,32.2 66.2,32.2 v66.5,31.9 | U1.10 59.25,14.25 v60.5,15.5 R3.2
  Bottom 0.2: v66.5,31.9 67.22,31.18 68.41,31.18 70.88,28.71 70.88,21.29 66.89,17.3 62.3,17.3 v60.5,15.5
PLL_FASTLOCK_SW
  Top 0.254: U3.5 64.94,33.15 arc-45 65.3,33 65.45,32.85 arc45 65.81,32.7 R6.2
PLL_LE  (via drill 0.3)
  Top 0.2: v59.6,15.5 58.75,14.65 U1.11 | v65.7,31.6 65.15,32.15 U3.3
  Bottom 0.2: v59.6,15.5 61.73,17.63 66.75,17.63 70.55,21.43 70.55,28.57 68.27,30.85 66.45,30.85 v65.7,31.6
PLL_LOCK  (via drill 0.3)
  Top 0.2: U1.16 56.25,14.35 v55.1,15.5 | U3.25 59.5,29.8 59.1,29.4 v57.9,29.4
  Bottom 0.2: v57.9,29.4 57.5,29 57.5,17.9 v55.1,15.5
PLL_MUXOUT  (via drill 0.3)
  Top 0.2: U1.14 57.25,15.15 v56.9,15.5 | v62.2,28.7 62,28.9 U3.30
  Bottom 0.2: v56.9,15.5 58.15,16.75 58.15,27.35 59.2,28.4 59.2,29.2 59.7,29.7 61.2,29.7 v62.2,28.7
PLL_REF_ACC
  Top 0.254: U3.29 61.5,27.52 C9.2
PLL_REF_DCC
  Top 0.508: U2.3 C9.1
PLL_SCLK  (via drill 0.3)
  Top 0.2: U1.13 57.75,15.45 v57.8,15.5 | v65.2,30.2 64.25,31.15 U3.1
  Bottom 0.2: v57.8,15.5 60.58,18.28 66.48,18.28 69.9,21.7 69.9,28.3 68,30.2 v65.2,30.2
PLL_SDATA  (via drill 0.3)
  Top 0.2: U1.12 58.25,15.05 v58.7,15.5 | v65.41,30.91 64.68,31.65 U3.2
  Bottom 0.2: v58.7,15.5 61.15,17.95 66.62,17.95 70.23,21.57 70.23,28.43 68.14,30.53 65.8,30.53 v65.41,30.91
PLL_TEMP
  Top 0.254: C14.1 55.49,35.6 arc-45 56.19,35.31 57.56,33.94 arc45 58.26,33.65 U3.19
  Top 0.813: C14.1 C15.1
PLL_VCOM
  Top 0.254: U3.23 56.46,31.65 arc-45 56.1,31.8 56.05,31.85 arc45 55.69,32 C13.1
  Top 0.813: C12.1 C13.1
PLL_VREF
  Top 0.254: C11.1 56,28.4 arc90 57,29.4 57,30.15 arc-90 58,31.15 U3.24
  Top 0.813: C10.1 C11.1
PLL_VTUNE  (via drill 0.3)
  Top 0.254: U3.20 57.85,33.15 v57.8,33.1
  Top 0.813: R8.1 69.4,36.38 v70.2,36.38 C21.1
  Bottom 0.254: v57.8,33.1 57.8,33.01 arc45 58.09,32.31 59.01,31.39 arc45 59.71,31.1 62.09,31.1 arc45 62.79,31.39 64.01,32.61 arc45 64.3,33.31 64.3,35.39 arc-45 64.59,36.09 arc-45 65.3,36.38 v70.2,36.38
RF_ACC
  Top 0.5: C28.2 51.22,50.5 C29.1 L7.1 49.38,50.5 U5.4
RF_ACC_FILT
  Top 0.5: C30.1 43.58,50.5 | 43.58,50.5 L8.1 | U5.2 43.58,50.5
SWCLK  (via drill 0.3)
  Top 0.2: U1.1 65.85,8.85 v65.9,8.9
  Bottom 0.2: v65.9,8.9 69.2,12.2 71.3,12.2 v72.47,11.03
SWDIO  (via drill 0.3)
  Top 0.2: U1.2 65.55,9.35 v65.9,9.7
  Bottom 0.2: v65.9,9.7 66.24,9.7 69.06,12.53 71.42,12.53 v72.47,13.57
SWO  (via drill 0.3)
  Top 0.2: U1.3 65.05,9.85 65.5,10.3 67.3,10.3 v68.6,9
  Bottom 0.2: v68.6,9 69,8.6 71,8.6 72.16,9.76 TC1.6
  other vias: 73.73,9.76
VIN  (via drill 0.3, 0.3 pad 0.9, 0.3 pad 1.3)
  Top 0.2: U12.14 12.45,31.75 12.3,31.9 C70.1 | U10.14 27.05,9.45 27.4,9.8 v28.5,9.8
  Top 0.305: U12.11 13.95,31.75 v14.1,31.9 14.1,33 C68.1 | U12.6 13.95,26.55 13.9,26.5 | v29,4.3 28.55,4.75 U10.6 | U10.11 28.55,9.75 v28.5,9.8
  Top 0.508: R16.2 22.08,23.82 v22.1,23.8
  Top 0.61: 13.9,26.5 13.9,24.7 v14.5,24.1 C72.1
  Top 0.813: C70.1 14.02,33.08 14.1,33 | C51.1 C54.1 29.28,4.02 v29,4.3 | v28.5,9.8 25,13.3 C56.1 22.42,15.72 D5.C
  Bottom 0.508: 17.6,21 19.3,21 v22.1,23.8
  Bottom 0.813: v17.6,16.7 17.6,21 v14.5,24.1 15.5,25.1 15.5,30.5 v14.1,31.9 | v28.5,9.8 29.9,8.4 29.9,5.2 v29,4.3
  pour Top (no thermals): 16.5,18 27.4,18 27.4,16.4 26.3,15.3 16.5,15.3
VIN_VSENSE  (via drill 0.3)
  Top 0.254: U1.21 53.85,10.35 53.6,10.6 v52.7,10.6 C53.1 | R17.2 25.48,23.42 v25.5,23.4 | v29.6,23.4 v33.7,23.4
  Top 0.813: R16.1 R17.2
  Bottom 0.254: v25.5,23.4 v29.6,23.4 | v33.7,23.4 39.9,23.4 v52.7,10.6

### Text on the board
tPlace: IcyRadio Upconverter v1 / May 2020 | RF OUT | IF IN | 0 | 1 | - | +